# EAGLE board M865C (EAGLE 6.6.0), part 1 of 2
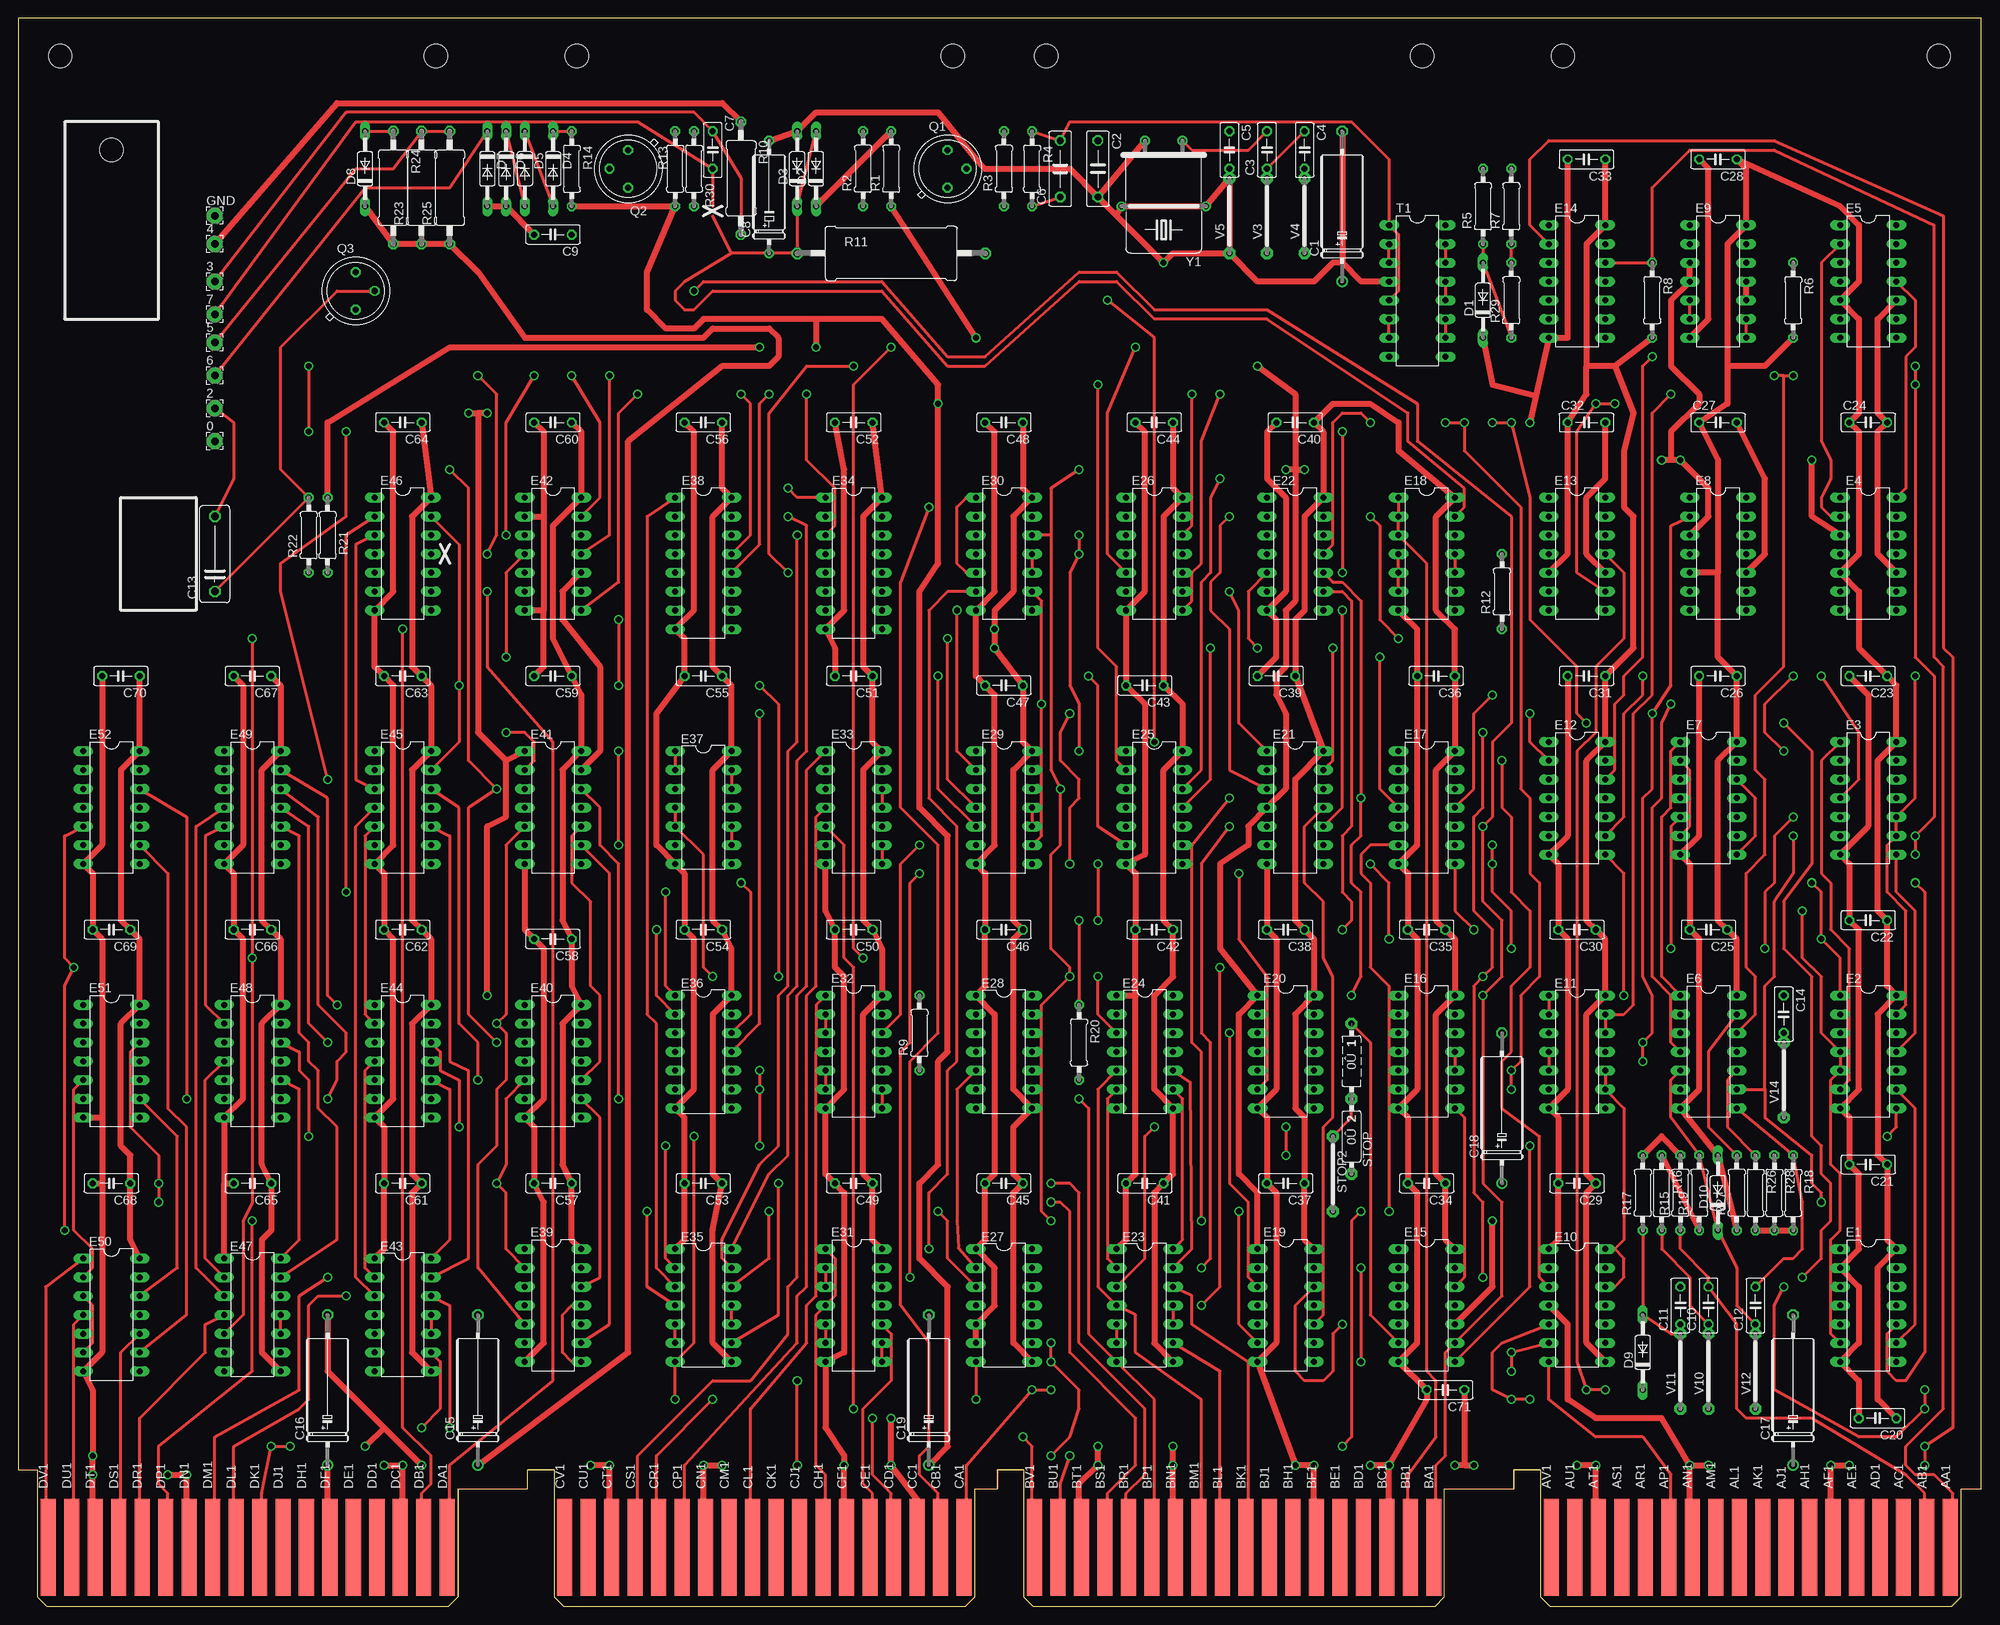
[diagram p2: board, top side]
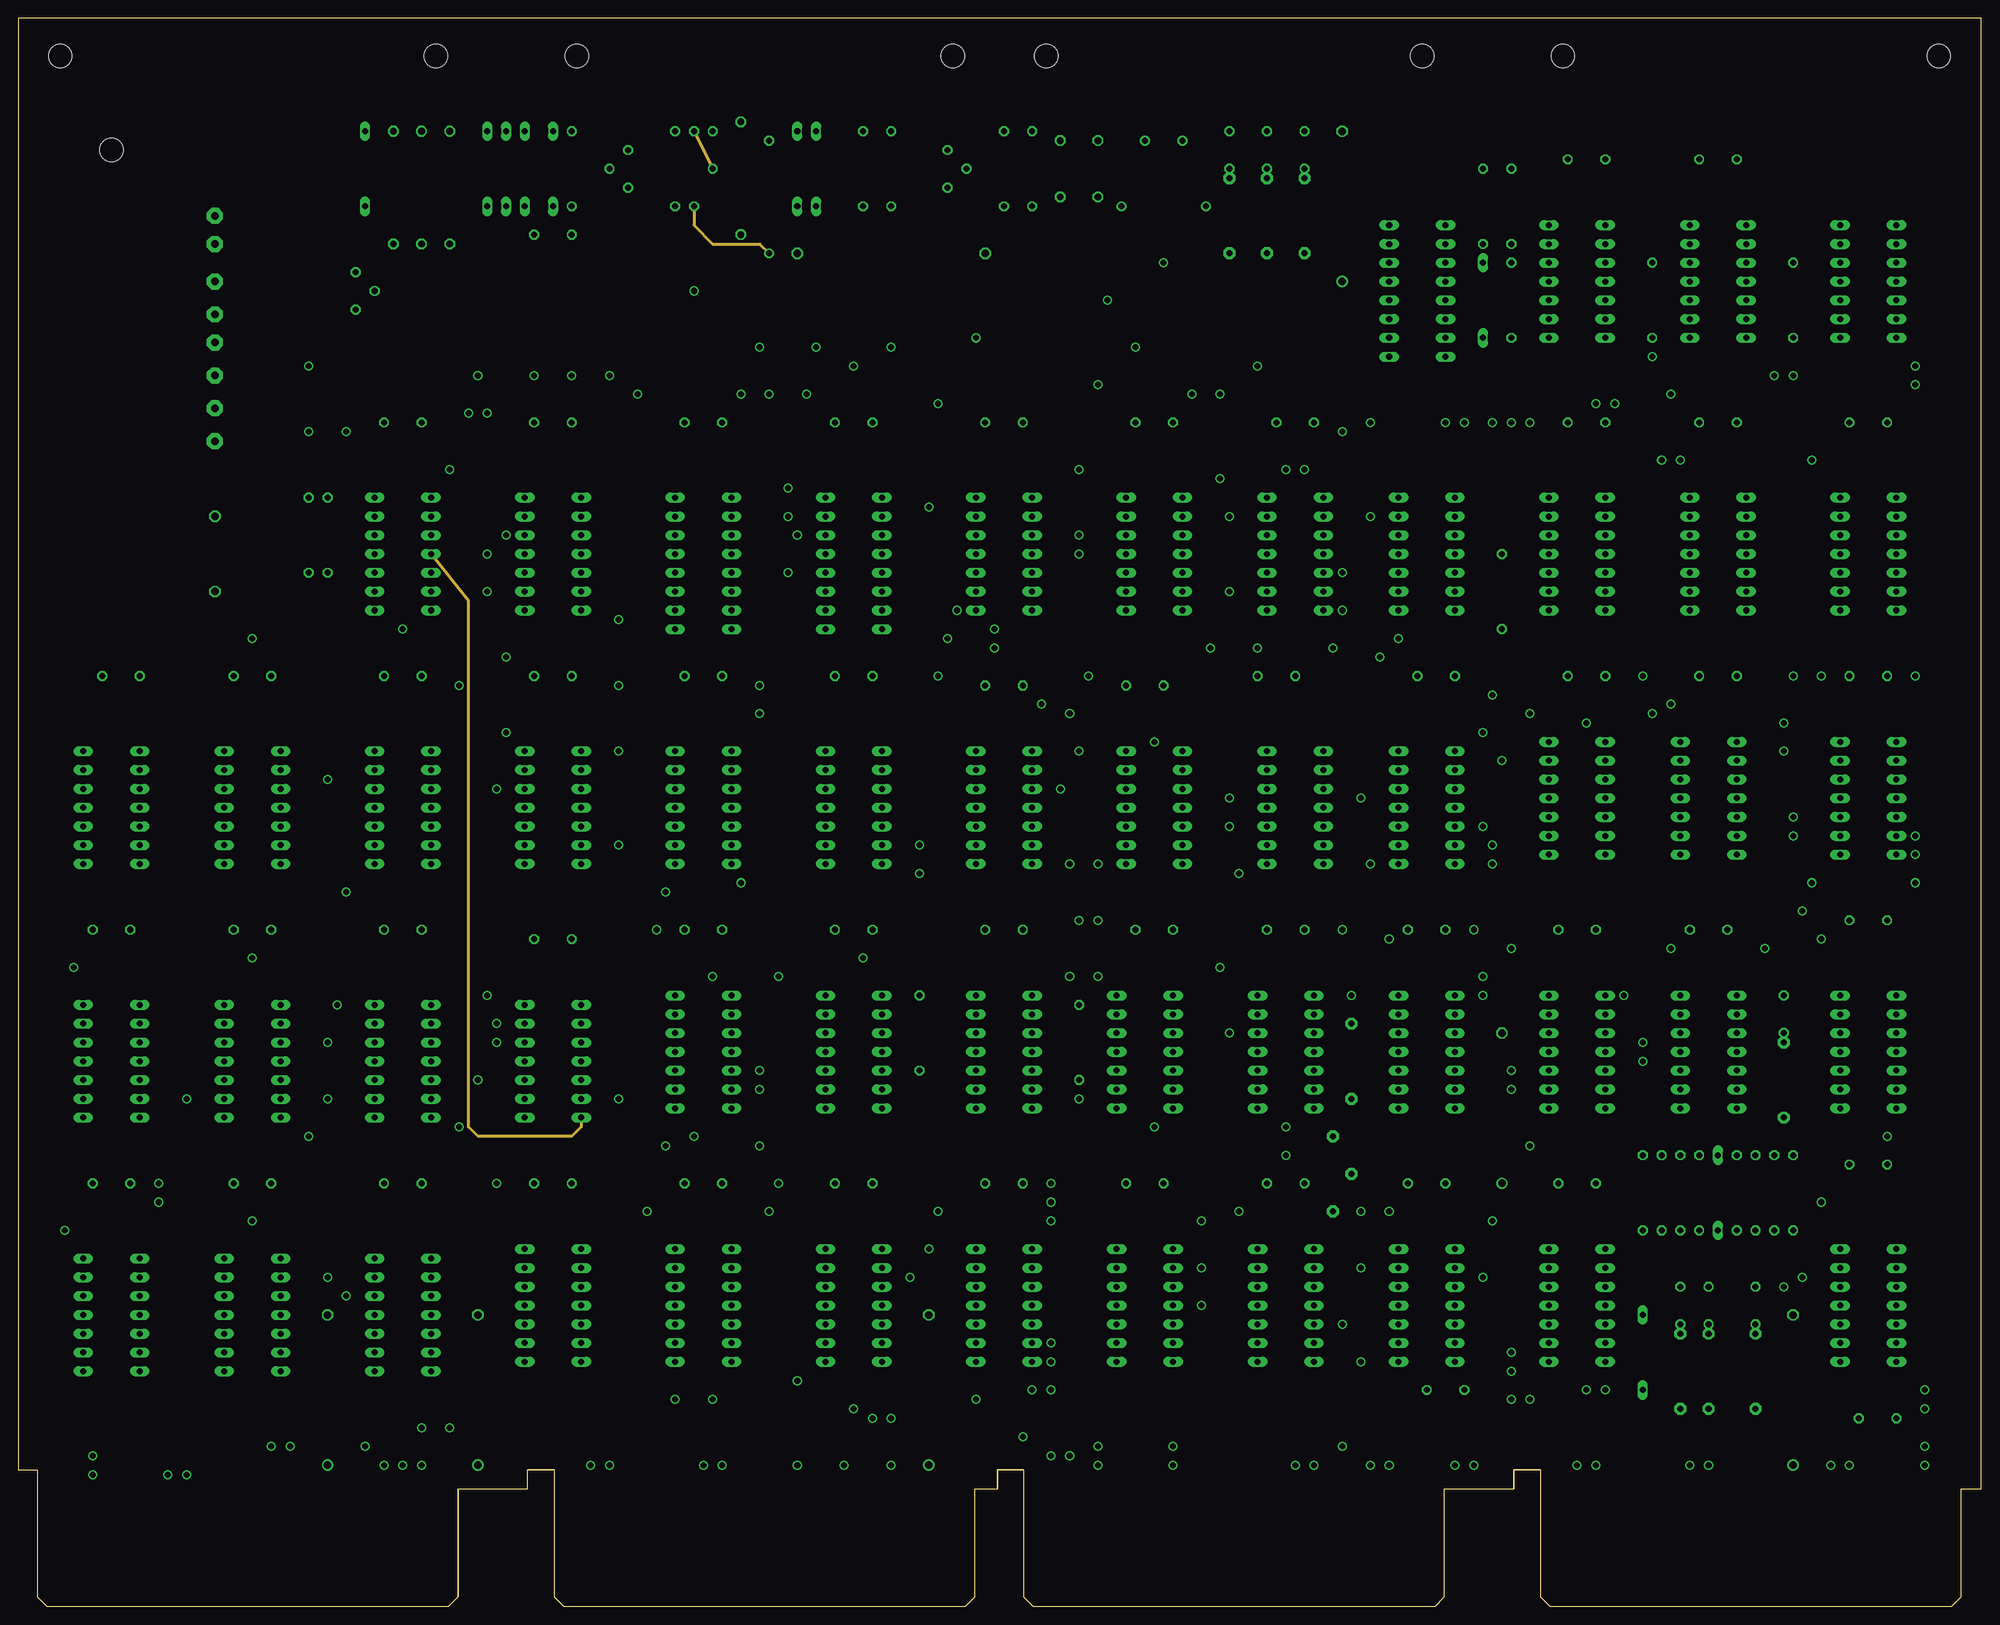
[diagram p3: board, inner layer ECO]
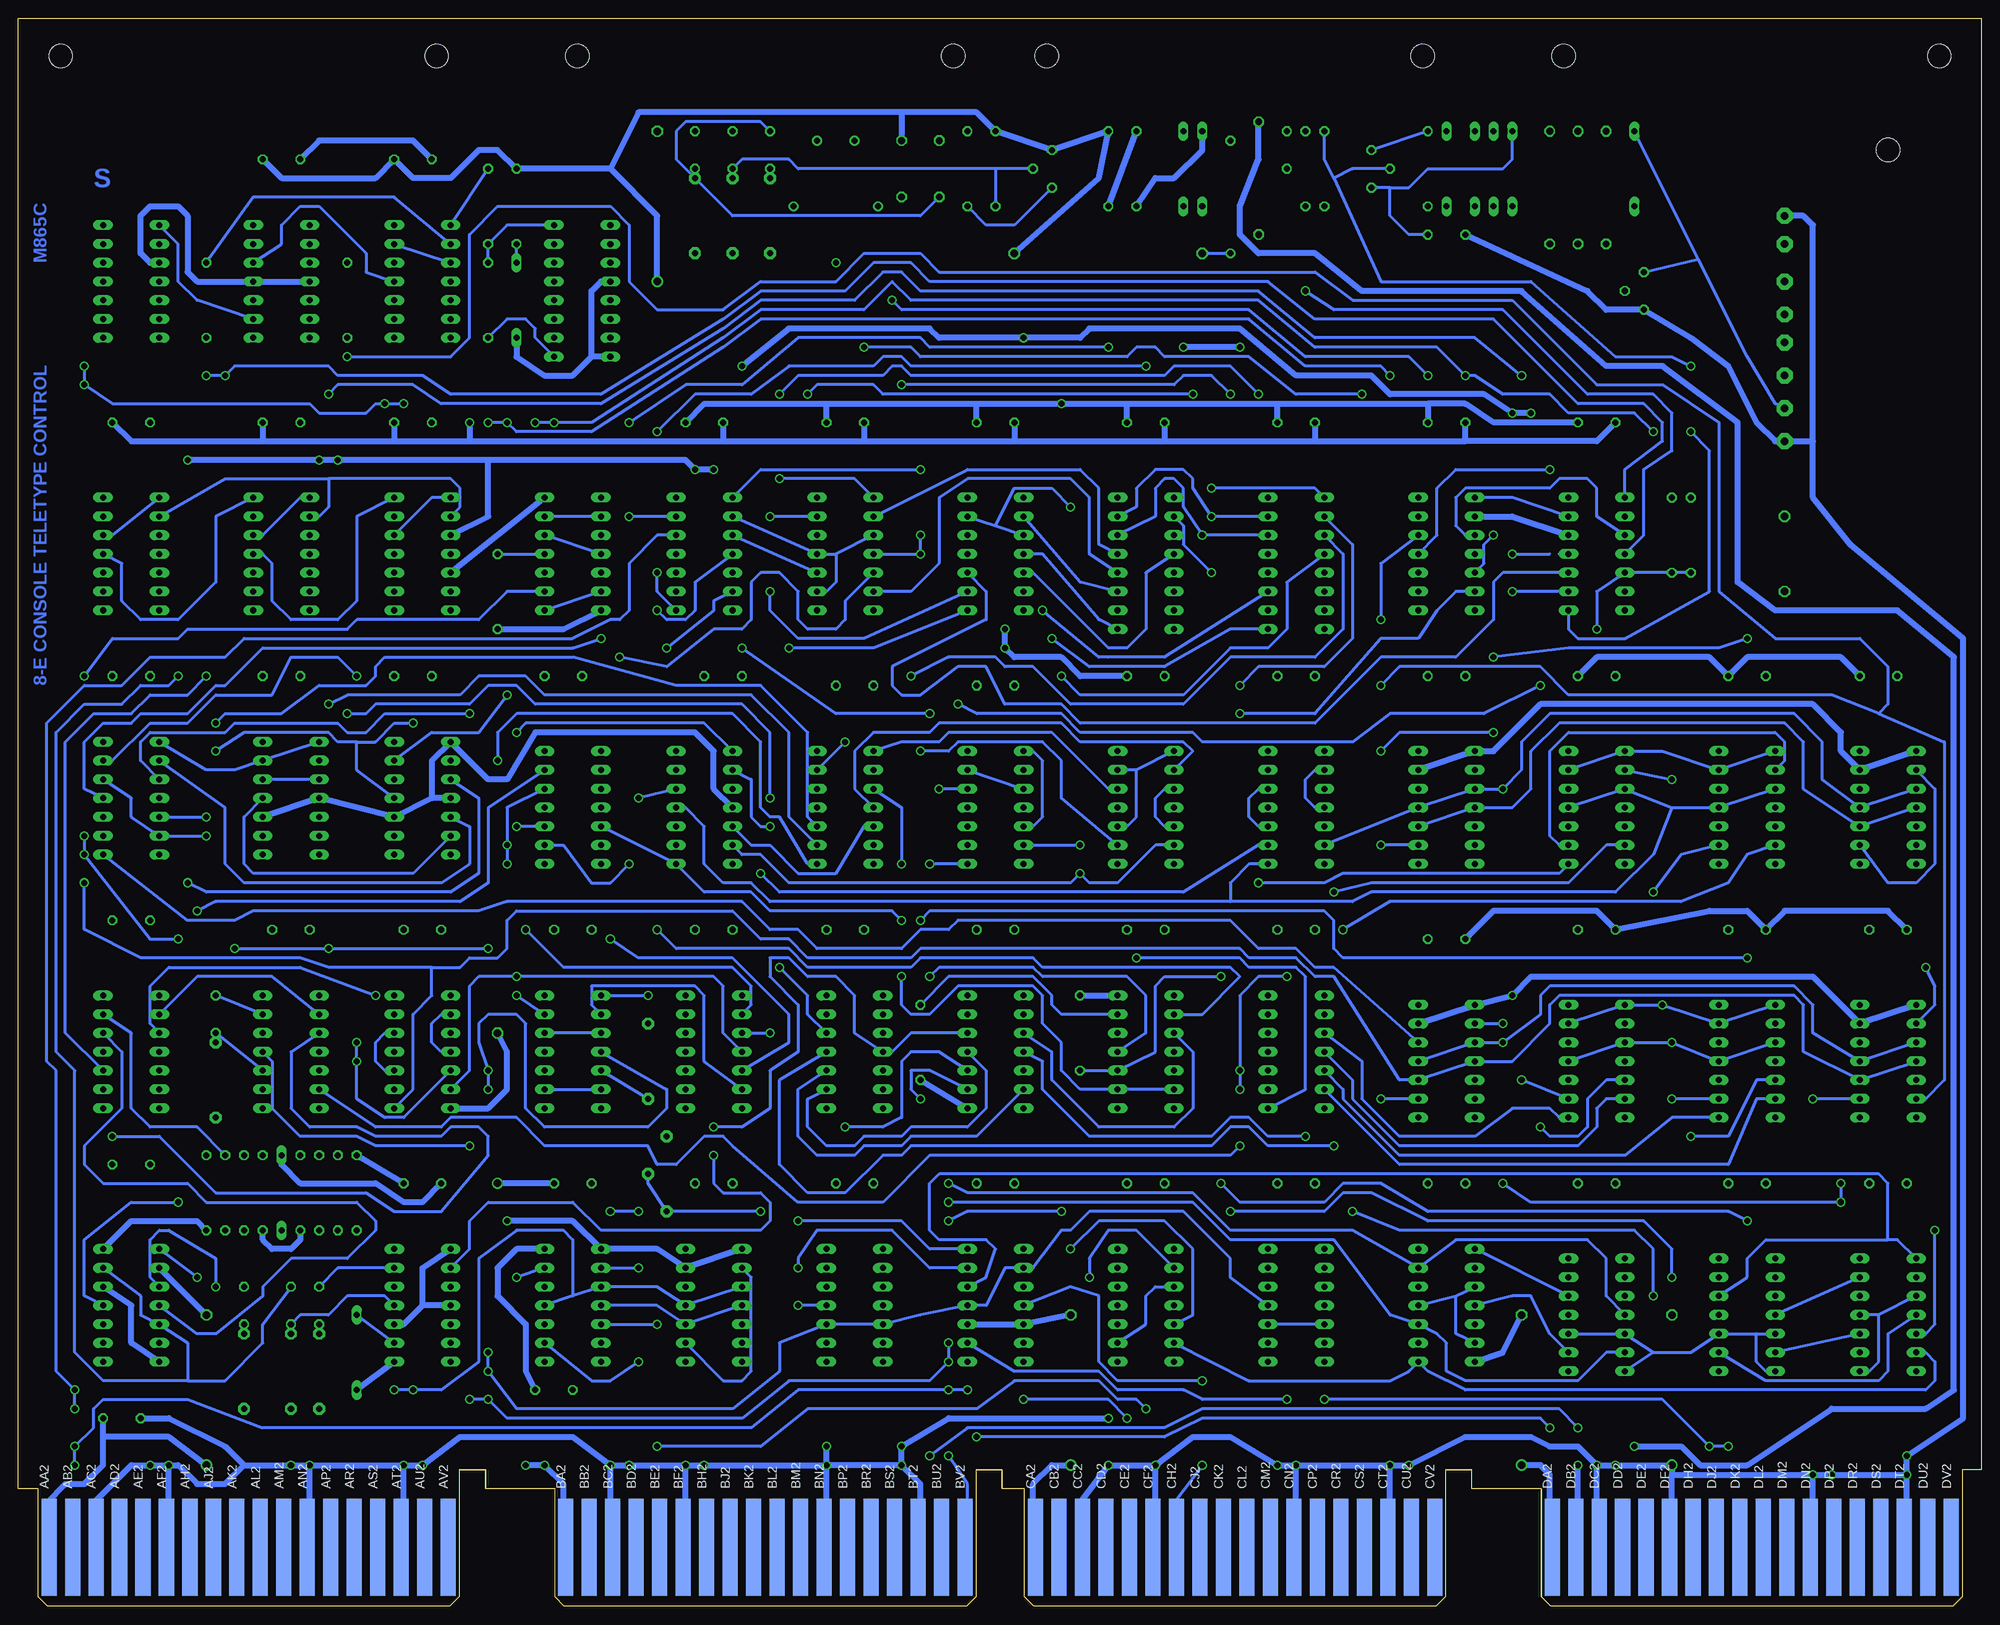
[diagram p4: board, bottom side, seen from below]

Size 265.3 x 214.63 mm. Coordinates in mm from the lower left corner, seen from the top.
Copper layers (1+2+16): Top 0.035mm / dielectric 1.5mm / ECO 0.035mm / dielectric 0.15mm / Bottom 0.035mm
Design rules "16mils *": minimum track width 16mil, minimum drill 32mil, track to track 15mil, track to pad 10mil, pad to pad 10mil, via to via 10mil, smd to smd 10mil, copper to edge 13mil, drill to drill 10mil, minimum pad ring 10mil, minimum via ring 8mil, stop-mask expansion 0mil, vias tented up to drill 0mil, thermal gap 10mil
Net classes: 1 Supply: width 0.813 mm
Holes 3.17 mm at 12.57,196.85

## Footprints (pad centres in the part's own frame; a part is rotated, then mirrored left to right if it is on the bottom)
2,15/1,0 = drill 1.016 pad 2.159 octagon: 1 0,0
E12-8 = drill 1.016: + -10.16,0 | drill 1.016 octagon: - 10.16,0
C075-032X103 = drill 0.914 octagon: 1 -3.81,0; 2 3.81,0
C050-025X075 = drill 0.813 octagon: 1 -2.54,0; 2 2.54,0
E15-5 = drill 0.813: + -7.62,0 | drill 0.813 octagon: - 7.62,0
C102-043X133 = drill 1.016 octagon: 1 -5.08,0; 2 5.08,0
DO35-10 = drill 0.813 long: A 5.08,0; C -5.08,0
DIL14 = drill 0.813 long: 1 -7.62,-3.81; 2 -5.08,-3.81; 3 -2.54,-3.81; 4 0,-3.81; 5 2.54,-3.81; 6 5.08,-3.81; 7 7.62,-3.81; 8 7.62,3.81; 9 5.08,3.81; 10 2.54,3.81; 11 0,3.81; 12 -2.54,3.81; 13 -5.08,3.81; 14 -7.62,3.81
DIL16 = drill 0.813 long: 1 -8.89,-3.81; 2 -6.35,-3.81; 3 -3.81,-3.81; 4 -1.27,-3.81; 5 1.27,-3.81; 6 3.81,-3.81; 7 6.35,-3.81; 8 8.89,-3.81; 9 8.89,3.81; 10 6.35,3.81; 11 3.81,3.81; 12 1.27,3.81; 13 -1.27,3.81; 14 -3.81,3.81; 15 -6.35,3.81; 16 -8.89,3.81
TO5 = drill 0.813 octagon: 1 0,-2.54; 2 2.54,0; 3 0,2.54
0207/10 = drill 0.813 octagon: 1 -5.08,0; 2 5.08,0
0411/15 = drill 0.914 octagon: 1 -7.62,0; 2 7.62,0
0818/25 = drill 1.016 octagon: 1 -12.7,0; 2 12.7,0
0R2/10 = drill 0.813 pad 1.6 octagon: 1 -5.08,0; 2 5.08,0; 3 15.24,0
10 = drill 0.813 pad 1.6 octagon: 1 -5.08,0; 2 5.08,0
EDGE-CON8 = smd 2.032 x 13.106: AA1 261.303,7.938; AB1 258.127,7.938; AC1 254.952,7.938; AD1 251.778,7.938; AE1 248.602,7.938; AF1 245.428,7.938; AH1 242.252,7.938; AJ1 239.077,7.938; AK1 235.903,7.938; AL1 232.727,7.938; AM1 229.553,7.938; AN1 226.377,7.938; AP1 223.202,7.938; AR1 220.028,7.938; AS1 216.852,7.938; AT1 213.678,7.938; AU1 210.502,7.938; AV1 207.327,7.938; BA1 191.452,7.938; BB1 188.278,7.938; BC1 185.102,7.938; BD1 181.928,7.938; BE1 178.752,7.938; BF1 175.577,7.938; BH1 172.403,7.938; BJ1 169.227,7.938; BK1 166.053,7.938; BL1 162.877,7.938; BM1 159.702,7.938; BN1 156.528,7.938; BP1 153.352,7.938; BR1 150.178,7.938; BS1 147.002,7.938; BT1 143.827,7.938; BU1 140.653,7.938; BV1 137.477,7.938; CA1 127.953,7.938; CB1 124.778,7.938; CC1 121.603,7.938; CD1 118.427,7.938; CE1 115.252,7.938; CF1 112.078,7.938; CH1 108.903,7.938; CJ1 105.728,7.938; CK1 102.552,7.938; CL1 99.377,7.938; CM1 96.203,7.938; CN1 93.028,7.938; CP1 89.853,7.938; CR1 86.677,7.938; CS1 83.502,7.938; CT1 80.328,7.938; CU1 77.153,7.938; CV1 73.978,7.938; DA1 58.102,7.938; DB1 54.928,7.938; DC1 51.752,7.938; DD1 48.578,7.938; DE1 45.403,7.938; DF1 42.227,7.938; DH1 39.053,7.938; DJ1 35.877,7.938; DK1 32.703,7.938; DL1 29.527,7.938; DM1 26.352,7.938; DN1 23.177,7.938; DP1 20.003,7.938; DR1 16.828,7.938; DS1 13.652,7.938; DT1 10.477,7.938; DU1 7.303,7.938; DV1 4.128,7.938 | smd 2.032 x 13.106 bottom: AA2 261.303,7.938; AB2 258.127,7.938; AC2 254.952,7.938; AD2 251.778,7.938; AE2 248.602,7.938; AF2 245.428,7.938; AH2 242.252,7.938; AJ2 239.077,7.938; AK2 235.903,7.938; AL2 232.727,7.938; AM2 229.553,7.938; AN2 226.377,7.938; AP2 223.202,7.938; AR2 220.028,7.938; AS2 216.852,7.938; AT2 213.678,7.938; AU2 210.502,7.938; AV2 207.327,7.938; BA2 191.452,7.938; BB2 188.278,7.938; BC2 185.102,7.938; BD2 181.928,7.938; BE2 178.752,7.938; BF2 175.577,7.938; BH2 172.403,7.938; BJ2 169.227,7.938; BK2 166.053,7.938; BL2 162.877,7.938; BM2 159.702,7.938; BN2 156.528,7.938; BP2 153.352,7.938; BR2 150.178,7.938; BS2 147.002,7.938; BT2 143.827,7.938; BU2 140.653,7.938; BV2 137.477,7.938; CA2 127.953,7.938; CB2 124.778,7.938; CC2 121.603,7.938; CD2 118.427,7.938; CE2 115.252,7.938; CF2 112.078,7.938; CH2 108.903,7.938; CJ2 105.728,7.938; CK2 102.552,7.938; CL2 99.377,7.938; CM2 96.203,7.938; CN2 93.028,7.938; CP2 89.853,7.938; CR2 86.677,7.938; CS2 83.502,7.938; CT2 80.328,7.938; CU2 77.153,7.938; CV2 73.978,7.938; DA2 58.102,7.938; DB2 54.928,7.938; DC2 51.752,7.938; DD2 48.578,7.938; DE2 45.403,7.938; DF2 42.227,7.938; DH2 39.053,7.938; DJ2 35.877,7.938; DK2 32.703,7.938; DL2 29.527,7.938; DM2 26.352,7.938; DN2 23.177,7.938; DP2 20.003,7.938; DR2 16.828,7.938; DS2 13.652,7.938; DT2 10.477,7.938; DU2 7.303,7.938; DV2 4.128,7.938
OMNIBUS = hole 3.175: 208.915,209.55; 259.715,209.55; 189.865,209.55; 139.065,209.55; 75.616,209.55; 126.416,209.55; 56.566,209.55; 5.766,209.55
HC18U-H = drill 0.813: 1 -2.54,-5.08; 2 2.54,-5.08; M -5.715,3.81; M1 5.715,3.81

## Placement (x,y rotation side)
0  [2,15/1,0]  26.54,157.48 0 top
2  [2,15/1,0]  26.54,161.93 0 top
3  [2,15/1,0]  26.54,179.07 0 top
4  [2,15/1,0]  26.54,184.15 0 top
5  [2,15/1,0]  26.54,170.81 0 top
6  [2,15/1,0]  26.54,166.37 0 top
7  [2,15/1,0]  26.54,174.62 0 top
C1  6.8uF  [E12-8]  178.94,189.23 90 top
C2  .047uF  [C075-032X103]  145.92,194.31 270 top
C3  33pF  [C050-025X075]  168.78,196.85 90 top
C4  100pF  [C050-025X075]  173.86,196.85 270 top
C5  68pF  [C050-025X075]  163.7,196.85 270 top
C6  .047uF  [C075-032X103]  140.84,194.31 90 top
C7  .01uF  [C050-025X075]  93.85,196.85 90 top
C8  1uF  [E15-5]  101.47,190.5 90 top
C9  .01uF  [C050-025X075]  72.26,185.42 180 top
C10  56pF  [C050-025X075]  228.47,40.64 90 top
C11  330pF  [C050-025X075]  224.66,40.64 90 top
C12  330pF  [C050-025X075]  234.82,40.64 90 top
C13  3300pF  [C102-043X133]  26.54,142.24 90 top
C14  330pF  [C050-025X075]  238.63,80.01 270 top
C15  6.8uF  [E12-8]  62.1,29.21 90 top
C16  6.8uF  [E12-8]  41.78,29.21 90 top
C17  6.8uF  [E12-8]  239.9,29.21 90 top
C18  6.8uF  [E12-8]  200.53,67.31 90 top
C19  6.8uF  [E12-8]  123.06,29.21 90 top
C20  .01uF  [C050-025X075]  251.33,25.4 180 top
C21  .01uF  [C050-025X075]  250.06,59.69 180 top
C22  .01uF  [C050-025X075]  250.06,92.71 180 top
C23  .01uF  [C050-025X075]  250.06,125.73 180 top
C24  .01uF  [C050-025X075]  250.06,160.02 0 top
C25  .01uF  [C050-025X075]  228.47,91.44 180 top
C26  .01uF  [C050-025X075]  229.74,125.73 180 top
C27  .01uF  [C050-025X075]  229.74,160.02 0 top
C28  .01uF  [C050-025X075]  229.74,195.58 180 top
C29  .01uF  [C050-025X075]  210.69,57.15 180 top
C30  .01uF  [C050-025X075]  210.69,91.44 180 top
C31  .01uF  [C050-025X075]  211.96,125.73 180 top
C32  .01uF  [C050-025X075]  211.96,160.02 0 top
C33  .01uF  [C050-025X075]  211.96,195.58 180 top
C34  .01uF  [C050-025X075]  190.37,57.15 180 top
C35  .01uF  [C050-025X075]  190.37,91.44 180 top
C36  .01uF  [C050-025X075]  191.64,125.73 180 top
C37  .01uF  [C050-025X075]  171.32,57.15 180 top
C38  .01uF  [C050-025X075]  171.32,91.44 180 top
C39  .01uF  [C050-025X075]  170.05,125.73 180 top
C40  .01uF  [C050-025X075]  172.59,160.02 180 top
C41  .01uF  [C050-025X075]  152.27,57.15 180 top
C42  .01uF  [C050-025X075]  153.54,91.44 180 top
C43  .01uF  [C050-025X075]  152.27,124.46 180 top
C44  .01uF  [C050-025X075]  153.54,160.02 180 top
C45  .01uF  [C050-025X075]  133.22,57.15 180 top
C46  .01uF  [C050-025X075]  133.22,91.44 180 top
C47  .01uF  [C050-025X075]  133.22,124.46 180 top
C48  .01uF  [C050-025X075]  133.22,160.02 180 top
C49  .01uF  [C050-025X075]  112.9,57.15 180 top
C50  .01uF  [C050-025X075]  112.9,91.44 180 top
C51  .01uF  [C050-025X075]  112.9,125.73 180 top
C52  .01uF  [C050-025X075]  112.9,160.02 180 top
C53  .01uF  [C050-025X075]  92.58,57.15 180 top
C54  .01uF  [C050-025X075]  92.58,91.44 180 top
C55  .01uF  [C050-025X075]  92.58,125.73 180 top
C56  .01uF  [C050-025X075]  92.58,160.02 180 top
C57  .01uF  [C050-025X075]  72.26,57.15 180 top
C58  .01uF  [C050-025X075]  72.26,90.17 180 top
C59  .01uF  [C050-025X075]  72.26,125.73 180 top
C60  .01uF  [C050-025X075]  72.26,160.02 180 top
C61  .01uF  [C050-025X075]  51.94,57.15 180 top
C62  .01uF  [C050-025X075]  51.94,91.44 180 top
C63  .01uF  [C050-025X075]  51.94,125.73 180 top
C64  .01uF  [C050-025X075]  51.94,160.02 180 top
C65  .01uF  [C050-025X075]  31.62,57.15 180 top
C66  .01uF  [C050-025X075]  31.62,91.44 180 top
C67  .01uF  [C050-025X075]  31.62,125.73 180 top
C68  .01uF  [C050-025X075]  12.57,57.15 180 top
C69  .01uF  [C050-025X075]  12.57,91.44 180 top
C70  .01uF  [C050-025X075]  13.84,125.73 180 top
C71  .01uF  [C050-025X075]  192.91,29.21 180 top
D1  D662  [DO35-10]  197.99,176.53 90 top
D2  D664  [DO35-10]  107.82,194.31 90 top
D3  D664  [DO35-10]  105.28,194.31 90 top
D4  D664  [DO35-10]  72.26,194.31 270 top
D5  D664  [DO35-10]  68.45,194.31 270 top
D6  D664  [DO35-10]  65.91,194.31 270 top
D7  D664  [DO35-10]  63.37,194.31 270 top
D8  D664  [DO35-10]  46.86,194.31 90 top
D9  D664  [DO35-10]  219.58,34.29 90 top
D10  D664  [DO35-10]  229.74,55.88 90 top
E1  7474N  [DIL14]  250.06,40.64 270 top
E2  7410N  [DIL14]  250.06,74.93 270 top
E3  7400N  [DIL14]  250.06,109.22 270 top
E4  74LS93N  [DIL14]  250.06,142.24 270 top
E5  74LS93N  [DIL14]  250.06,179.07 270 top
E6  7404N  [DIL14]  228.47,74.93 270 top
E7  7474N  [DIL14]  228.47,109.22 270 top
E8  74LS93N  [DIL14]  229.74,142.24 270 top
E9  74H72N  [DIL14]  229.74,179.07 270 top
E10  SP380N  [DIL14]  210.69,40.64 270 top
E11  7440N  [DIL14]  210.69,74.93 270 top
E12  7474N  [DIL14]  210.69,109.22 270 top
E13  74LS93N  [DIL14]  210.69,142.24 270 top
E14  74H00N  [DIL14]  210.69,179.07 270 top
E15  7474N  [DIL14]  190.37,40.64 270 top
E16  7400N  [DIL14]  190.37,74.93 270 top
E17  7400N  [DIL14]  190.37,107.95 270 top
E18  7460N  [DIL14]  190.37,142.24 270 top
E19  7474N  [DIL14]  171.32,40.64 270 top
E20  7474N  [DIL14]  171.32,74.93 270 top
E21  7474N  [DIL14]  172.59,107.95 270 top
E22  7404N  [DIL14]  172.59,142.24 270 top
E23  SP380N  [DIL14]  152.27,40.64 270 top
E24  SP314N  [DIL14]  152.27,74.93 270 top
E25  7402N  [DIL14]  153.54,107.95 270 top
E26  7402N  [DIL14]  153.54,142.24 270 top
E27  SP384N  [DIL14]  133.22,40.64 270 top
E28  SP314N  [DIL14]  133.22,74.93 270 top
E29  7400N  [DIL14]  133.22,107.95 270 top
E30  7400N  [DIL14]  133.22,142.24 270 top
E31  97401N  [DIL14]  112.9,40.64 270 top
E32  97401N  [DIL14]  112.9,74.93 270 top
E33  97401N  [DIL14]  112.9,107.95 270 top
E34  DEC8251  [DIL16]  112.9,140.97 270 top
E35  SP380N  [DIL14]  92.58,40.64 270 top
E36  7430N  [DIL14]  92.58,74.93 270 top
E37  7440N  [DIL14]  92.58,107.95 270 top
E38  DEC8251  [DIL16]  92.58,140.97 270 top
E39  97401N  [DIL14]  72.26,40.64 270 top
E40  7474N  [DIL14]  72.26,73.66 270 top
E41  7474N  [DIL14]  72.26,107.95 270 top
E42  7474N  [DIL14]  72.26,142.24 270 top
E43  SP384N  [DIL14]  51.94,39.37 270 top
E44  7474N  [DIL14]  51.94,73.66 270 top
E45  7474N  [DIL14]  51.94,107.95 270 top
E46  7474N  [DIL14]  51.94,142.24 270 top
E47  SP384N  [DIL14]  31.62,39.37 270 top
E48  7474N  [DIL14]  31.62,73.66 270 top
E49  7474N  [DIL14]  31.62,107.95 270 top
E50  97401N  [DIL14]  12.57,39.37 270 top
E51  7474N  [DIL14]  12.57,73.66 270 top
E52  7474N  [DIL14]  12.57,107.95 270 top
GND  [2,15/1,0]  26.54,187.96 0 top
Q1  2N3009B  [TO5]  125.6,194.31 0 top
Q2  MPS6534D  [TO5]  82.42,194.31 180 top
Q3  2N3009B  [TO5]  45.59,177.8 0 top
R1  330  [0207/10]  117.98,194.31 90 top
R2  750  [0207/10]  114.17,194.31 90 top
R3  10K  [0207/10]  133.22,194.31 90 top
R4  220  [0207/10]  137.03,194.31 270 top
R5  470  [0207/10]  197.99,189.23 90 top
R6  1.5K  [0207/10]  239.9,176.53 270 top
R7  470  [0207/10]  201.8,189.23 90 top
R8  1.5K  [0207/10]  220.85,176.53 270 top
R9  470  [0207/10]  121.79,77.47 90 top
R10  560 1/2W  [0411/15]  97.66,193.04 270 top
R11  750 2W  [0818/25]  117.98,182.88 0 top
R12  100  [0207/10]  200.53,137.16 90 top
R13  1K  [0207/10]  88.77,194.31 270 top
R14  150  [0207/10]  74.8,194.31 270 top
R15  4.7K  [0207/10]  224.66,55.88 90 top
R16  7.5K  [0207/10]  222.12,55.88 270 top
R17  1.8K  [0207/10]  219.58,55.88 90 top
R18  470  [0207/10]  239.9,55.88 270 top
R19  220  [0207/10]  227.2,55.88 90 top
R20  470  [0207/10]  143.38,76.2 270 top
R21  1.5K  [0207/10]  41.78,144.78 90 top
R22  390  [0207/10]  39.24,144.78 90 top
R23  680 1/2W  [0411/15]  54.48,191.77 90 top
R24  750 1/2W  [0411/15]  50.67,191.77 270 top
R25  680 1/2W  [0411/15]  58.29,191.77 90 top
R26  470  [0207/10]  234.82,55.88 270 top
R27  220  [0207/10]  232.28,55.88 90 top
R28  1K  [0207/10]  237.36,55.88 270 top
R29  3.3K  [0207/10]  201.8,176.53 90 top
R30  180  [0207/10]  91.31,194.31 270 top
STOP  [0R2/10]  180.21,63.5 90 top
STOP2  [10]  177.67,58.42 270 top
T1  16-09651  [DIL16]  189.1,177.8 270 top
U$1  [EDGE-CON8]  -0.13,0 0 top
U$2  OUTLINE-OMNIBUS  [OMNIBUS]  -0.13,0 0 top
V3  [10]  168.78,187.96 90 top
V4  [10]  173.86,187.96 90 top
V5  [10]  163.7,187.96 90 top
V10  [10]  228.47,31.75 90 top
V11  [10]  224.66,31.75 90 top
V12  [10]  234.82,31.75 90 top
V14  [10]  238.63,71.12 90 top
Y1  14.418MHz  [HC18U-H]  154.81,193.04 180 top

## Tracks (layer width: path | path; a pad name or v marks a point on that pad's centre or on a via)
603X  (via drill 0.81)
  Top 0.406: E32.2 E32.3 | E22.9 178.94,137.16 180.21,135.89 180.21,105.41 178.94,104.14 178.94,96.52 180.21,95.25 180.21,92.71 v178.94,91.44
  Bottom 0.406: E32.2 105.28,80.01 100.2,85.09 101.47,86.36 126.87,86.36 128.14,87.63 143.38,87.63 144.65,86.36 158.62,86.36 161.16,88.9 176.4,88.9 v178.94,91.44 | E32.3 106.55,74.93 106.55,67.31 109.09,64.77 119.25,64.77 125.6,71.12 125.6,74.93 E28.3
604X  (via drill 0.81)
  Top 0.406: E32.5 E32.6 | E32.9 E32.8 | E24.3 145.92,80.01 v145.92,85.09
  Bottom 0.406: E32.6 E32.9 121.79,69.85 124.33,72.39 124.33,76.2 126.87,78.74 126.87,82.55 128.14,83.82 138.3,83.82 142.11,80.01 144.65,80.01 145.92,81.28 v145.92,85.09
!603  (via drill 0.81)
  Top 0.406: v104.01,139.7 101.47,142.24 101.47,161.29 106.55,167.64 v112.9,167.64 | v178.94,158.75 v178.94,139.7
  Bottom 0.406: E34.2 107.82,146.05 107.82,143.51 v104.01,139.7 | E22.8 178.94,137.16 v178.94,139.7 | v112.9,167.64 144.65,167.64 145.92,168.91 148.46,168.91 149.73,167.64 161.16,167.64 166.24,163.83 173.86,163.83 v178.94,158.75
!604  (via drill 0.81)
  Top 0.406: v100.2,124.46 102.74,121.92 v102.74,85.09
  Bottom 0.406: E38.2 84.96,143.51 84.96,130.81 88.77,127 97.66,127 v100.2,124.46 | R9.1 E32.10 111.63,74.93 111.63,83.82 110.36,85.09 v102.74,85.09
!C0
  Top 0.406: U$1.CE1 115.44,8.89 115.44,15.24 114.17,16.51 114.17,26.67 117.98,30.48 117.98,36.83 E31.10
!C1
  Top 0.406: U$1.CH1 109.09,8.89 109.09,17.78 107.82,19.05 107.82,39.37 E31.4 110.36,41.91 110.36,46.99 E31.1
!CLR_ACTIVE  (via drill 0.81)
  Top 0.406: v241.17,44.45 243.71,46.99 243.71,50.8 244.98,52.07 244.98,57.15 243.71,58.42 243.71,62.23 242.44,63.5 242.44,85.09 238.63,88.9 238.63,95.25 242.44,100.33 242.44,115.57 v238.63,119.38
  Bottom 0.406: E1.1 v241.17,44.45 | E25.10 158.62,106.68 158.62,118.11 164.97,124.46 176.4,124.46 190.37,128.27 215.77,128.27 217.04,127 217.04,125.73 218.31,124.46 224.66,124.46 229.74,120.65 237.36,120.65 v238.63,119.38
!DATA4  (via drill 0.81)
  Top 0.406: U$1.BR1 149.73,11.43 149.73,15.24 152.27,17.78 152.27,26.67 143.38,35.56 143.38,55.88 142.11,57.15 v139.57,57.15
  Bottom 0.406: E43.4 50.67,41.91 50.67,46.99 53.21,49.53 70.99,49.53 E39.13 84.96,50.8 101.47,50.8 106.55,55.88 137.03,55.88 v139.57,57.15
!DATA5  (via drill 0.81)
  Top 0.406: U$1.BS1 147.19,10.16 147.19,15.24 151,19.05 151,25.4 142.11,34.29 142.11,53.34 140.84,54.61 v139.57,54.61
  Bottom 0.406: E43.6 50.67,34.29 54.48,30.48 69.72,30.48 72.26,31.75 72.26,35.56 73.53,36.83 E39.10 79.88,39.37 87.5,49.53 101.47,49.53 106.55,54.61 v139.57,54.61
!DATA6  (via drill 0.81)
  Top 0.406: E43.9 57.02,33.02 57.02,26.67 v54.48,24.13 | U$1.BU1 140.84,10.16 140.84,16.51 v142.11,20.32
  Bottom 0.406: E43.9 58.29,36.83 60.83,41.91 63.37,41.91 E39.4 | v54.48,24.13 57.02,26.67 105.28,26.67 110.36,24.13 137.03,24.13 v142.11,20.32
!DATA7  (via drill 0.81)
  Top 0.406: U$1.BV1 137.03,10.16 137.03,21.59 v135.76,22.86 | E43.12 58.29,40.64 v58.29,24.13
  Bottom 0.406: E43.12 E39.1 | v58.29,24.13 59.56,25.4 105.28,25.4 110.36,22.86 v135.76,22.86
!DATA8
  Top 0.406: U$1.DR1 16.38,8.89 16.38,25.4 25.27,34.29 25.27,38.1 E47.4
  Bottom 0.406: E50.13 E47.4
!DATA9
  Top 0.406: U$1.DS1 13.84,8.89 13.84,34.29 E50.10
  Bottom 0.406: E50.10 E47.6
!DATA10
  Top 0.406: U$1.DU1 7.49,8.89 7.49,38.1 E50.4
  Bottom 0.406: E50.4 12.57,36.83 12.57,31.75 13.84,30.48 29.08,30.48 E47.9
!DATA11
  Top 0.406: E50.1 3.68,43.18 3.68,8.89 U$1.DV1
  Bottom 0.406: E50.1 11.3,49.53 12.57,49.53 | 12.57,49.53 12.57,57.15 13.84,58.42 140.84,58.42 142.11,57.15 142.11,50.8 140.84,49.53 134.49,49.53 133.22,48.26 134.49,44.45 E27.12 | E47.12 31.62,44.45 31.62,46.99 29.08,49.53 12.57,49.53
!DTX_ACTIVE  (via drill 0.81)
  Top 0.406: E6.12 234.82,80.01 234.82,85.09 233.55,86.36 233.55,99.06 236.09,101.6 236.09,111.76 234.82,113.03 234.82,123.19 238.63,127 238.63,166.37 | 238.63,166.37 v237.36,166.37 | 238.63,166.37 v239.9,166.37
  Bottom 0.406: E46.1 48.13,153.67 43.05,157.48 43.05,160.02 45.59,162.56 54.48,162.56 65.91,173.99 90.04,173.99 96.39,179.07 142.11,179.07 144.65,181.61 149.73,181.61 153.54,177.8 164.97,177.8 170.05,173.99 186.56,163.83 206.88,163.83 210.69,166.37 222.12,166.37 223.39,167.64 236.09,167.64 v237.36,166.37 v239.9,166.37
!ENABLE  (via drill 0.81)
  Top 0.406: E36.11 100.2,78.74 v100.2,120.65
  Bottom 0.406: E42.6 70.99,137.16 73.53,134.62 76.07,130.81 81.15,130.81 90.04,120.65 v100.2,120.65
!FREQ_DIV  (via drill 0.81)
  Top 0.406: v41.78,76.2 39.24,78.74 39.24,105.41 E49.11 | E46.3 45.59,143.51 45.59,111.76 E45.3 | E19.10 176.4,39.37 176.4,64.77 177.67,66.04 177.67,85.09 176.4,87.63 176.4,95.25 173.86,97.79 173.86,105.41 E21.11
  Bottom 0.406: E48.3 E48.11 v41.78,76.2 E44.3 E44.11 | E49.3 E49.11 41.78,107.95 | 41.78,107.95 E45.3 E45.11 | 41.78,107.95 44.32,101.6 49.4,96.52 82.42,96.52 84.96,95.25 101.47,95.25 | E46.3 51.94,147.32 51.94,151.13 53.21,152.4 57.02,152.4 58.29,151.13 69.72,151.13 70.99,149.86 70.99,146.05 69.72,144.78 E42.3 | E19.4 E19.10 178.94,40.64 E15.4 | 101.47,95.25 163.7,95.25 166.24,97.79 170.05,97.79 172.59,100.33 172.59,105.41 175.13,107.95 E21.11 | E37.8 98.93,100.33 101.47,97.79 101.47,95.25
!INITIALIZE  (via drill 0.81)
  Top 0.406: v43.05,81.28 41.78,82.55 41.78,109.22 E49.13 | E46.13 59.56,143.51 v59.56,124.46 59.56,116.84 E45.13 | v197.99,118.11 197.99,107.95 196.72,106.68 196.72,93.98 199.26,91.44 199.26,86.36 v197.99,85.09 196.72,83.82 196.72,55.88 197.99,54.61 v197.99,44.45 | E29.9 138.3,104.14 v138.3,121.92 138.3,135.89 E30.9 | E21.1 164.97,119.38 164.97,134.62 v163.7,137.16
  Bottom 0.406: E48.1 E48.13 v43.05,81.28 E44.1 E44.13 | E49.1 E49.13 43.05,115.57 E45.1 E45.13 | E46.13 63.37,149.86 E42.1 | E15.13 v197.99,44.45 | E20.4 170.05,77.47 170.05,83.82 171.32,85.09 v197.99,85.09 203.07,85.09 204.34,83.82 204.34,72.39 E11.6 | E21.1 172.59,119.38 196.72,119.38 v197.99,118.11 | E30.9 151,130.81 159.89,130.81 163.7,134.62 v163.7,137.16 | v59.56,124.46 67.18,120.65 79.88,120.65 84.96,116.84 105.28,116.84 106.55,118.11 121.79,118.11 124.33,120.65 135.76,120.65 v138.3,121.92
!INT_ENA
  Bottom 0.406: E21.5 166.24,102.87 163.7,102.87 159.89,99.06 154.81,99.06 151,105.41 E25.5
!INT_RQST
  Top 0.406: U$1.CP1 90.04,8.89 90.04,19.05 105.28,35.56 105.28,41.91 106.55,43.18 106.55,82.55 107.82,83.82 107.82,106.68 E33.4
!INTERNAL_IO
  Top 0.406: E32.1 107.82,81.28 107.82,74.93 | 107.82,74.93 E32.4 | U$1.CL1 98.93,8.89 98.93,26.67 106.55,35.56 106.55,40.64 107.82,41.91 107.82,74.93
!IO_PAUSE  (via drill 0.81)
  Top 0.406: E27.7 v129.41,27.94 | U$1.CD1 117.98,8.89 117.98,15.24 115.44,17.78 v115.44,25.4
  Bottom 0.406: v115.44,25.4 117.98,27.94 v129.41,27.94
!KCC
  Bottom 0.406: E34.11 121.79,138.43 E30.2
!KCF
  Bottom 0.406: E34.13 119.25,143.51 119.25,151.13 121.79,153.67 137.03,153.67 E26.2
!KIE  (via drill 0.81)
  Top 0.406: E26.12 158.62,146.05 v158.62,163.83 | E34.3 110.36,146.05 110.36,151.13 106.55,154.94 v106.55,163.83
  Bottom 0.406: v106.55,163.83 148.46,163.83 149.73,165.1 157.35,165.1 v158.62,163.83
!KRB
  Top 0.406: E30.5 128.14,139.7 126.87,140.97 126.87,148.59 128.14,149.86 E30.1
  Bottom 0.406: E34.4 112.9,139.7 112.9,132.08 115.44,129.54 117.98,129.54 128.14,139.7 E30.5
!KRS
  Bottom 0.406: E34.9 119.25,133.35 126.87,142.24 E30.4
!KSF
  Bottom 0.406: E34.12 120.52,142.24 120.52,149.86 123.06,152.4 137.03,152.4 140.84,149.86 140.84,140.97 144.65,137.16 E26.6
!LAST_UNIT  (via drill 0.81)
  Top 0.406: v217.04,82.55 217.04,99.06 E12.8
  Bottom 0.406: E2.3 247.52,78.74 247.52,83.82 244.98,86.36 227.2,86.36 v217.04,82.55
!MD3
  Top 0.406: U$1.AP1 223.39,10.16 223.39,17.78 219.58,22.86 213.23,22.86 206.88,27.94 E10.7
!MD4
  Top 0.406: U$1.BK1 166.24,8.89 166.24,33.02 158.62,38.1 158.62,41.91 E23.12
!MD5
  Top 0.406: U$1.BL1 162.43,10.16 162.43,31.75 E23.9
!MD6
  Top 0.406: U$1.BM1 159.89,10.16 159.89,27.94 151,34.29 151,39.37 E23.4 145.92,43.18 145.92,69.85 E24.5
!MD7  (via drill 0.81)
  Top 0.406: U$1.BP1 153.54,8.89 153.54,27.94 E23.7 144.65,36.83 144.65,67.31 v143.38,68.58
  Bottom 0.406: E28.9 142.11,72.39 144.65,72.39 144.65,69.85 v143.38,68.58
!MD8  (via drill 0.81)
  Top 0.406: U$1.DK1 32.89,8.89 32.89,15.24 v34.16,21.59 v36.7,21.59 | v88.77,27.94 E35.7 91.31,35.56 v91.31,63.5
  Bottom 0.406: v91.31,63.5 96.39,63.5 98.93,66.04 101.47,66.04 104.01,63.5 120.52,63.5 126.87,69.85 126.87,73.66 E28.4 | v34.16,21.59 v36.7,21.59 43.05,27.94 v88.77,27.94
!MD9  (via drill 0.81)
  Top 0.406: U$1.DL1 29.08,8.89 29.08,21.59 37.97,26.67 39.24,27.94 39.24,40.64 40.51,41.91 v44.32,41.91 | E35.4 84.96,43.18 v84.96,53.34
  Bottom 0.406: v44.32,41.91 44.32,48.26 46.86,50.8 78.61,50.8 v84.96,53.34
!MD10  (via drill 0.81)
  Top 0.406: U$1.DM1 26.54,7.62 26.54,22.86 37.97,29.21 37.97,41.91 v41.78,44.45 | E35.12 101.47,46.99 v101.47,53.34
  Bottom 0.406: v41.78,44.45 41.78,48.26 45.59,52.07 74.8,52.07 82.42,55.88 86.23,55.88 88.77,53.34 v101.47,53.34
!MD11  (via drill 0.81)
  Top 0.406: U$1.DP1 20.19,8.89 20.19,15.24 18.92,16.51 18.92,21.59 31.62,31.75 v31.62,52.07 | E35.9 102.74,39.37 v102.74,57.15
  Bottom 0.406: v31.62,52.07 34.16,53.34 74.8,53.34 81.15,57.15 86.23,57.15 88.77,54.61 100.2,54.61 v102.74,57.15
!POWER_OK  (via drill 0.81)
  Top 0.406: v200.53,114.3 200.53,107.95 201.8,106.68 201.8,96.52 204.34,93.98 204.34,86.36 201.8,83.82 201.8,74.93 200.53,73.66 200.53,67.31 205.61,63.5 205.61,44.45 E10.3
  Bottom 0.406: E25.8 158.62,100.33 162.43,106.68 163.7,106.68 164.97,107.95 164.97,116.84 168.78,120.65 197.99,120.65 200.53,118.11 v200.53,114.3
!PRESET
  Top 0.406: E3.1 243.71,114.3 243.71,99.06 244.98,97.79 244.98,91.44 247.52,88.9 247.52,71.12 E2.6 | E6.1 222.12,85.09 222.12,106.68 223.39,107.95 223.39,115.57 E7.1
  Bottom 0.406: E7.1 E7.13 236.09,113.03 239.9,113.03 E3.1
!RX_ACTIVE  (via drill 0.81)
  Top 0.406: E1.6 244.98,36.83 244.98,49.53 246.25,50.8 246.25,58.42 244.98,59.69 244.98,71.12 E2.5 E2.4 243.71,77.47 243.71,85.09 241.17,87.63 v241.17,93.98
  Bottom 0.406: E17.13 201.8,107.95 201.8,97.79 205.61,95.25 238.63,95.25 v241.17,93.98
!RX_CLK  (via drill 0.81)
  Top 0.406: E6.9 236.09,69.85 | 236.09,69.85 236.09,83.82 237.36,85.09 237.36,95.25 239.9,99.06 v239.9,104.14 | v243.71,54.61 243.71,55.88 242.44,57.15 242.44,60.96 236.09,66.04 236.09,69.85
  Bottom 0.406: E1.11 256.41,41.91 256.41,49.53 250.06,54.61 v243.71,54.61 | v239.9,104.14 E3.6 250.06,106.68 250.06,109.22 E3.12
!RX_CLR  (via drill 0.81)
  Top 0.406: E40.10 78.61,73.66 78.61,82.55 77.34,83.82 77.34,95.25 74.8,97.79 74.8,104.14 E41.10 | v256.41,97.79 257.68,96.52 257.68,34.29 255.14,30.48 253.87,30.48 252.6,31.75 252.6,36.83 E1.10
  Bottom 0.406: E51.4 E51.10 24,74.93 24,81.28 25.27,82.55 57.02,82.55 58.29,81.28 58.29,78.74 63.37,73.66 E40.4 E40.10 78.61,71.12 87.5,85.09 90.04,85.09 92.58,87.63 98.93,87.63 100.2,88.9 143.38,88.9 144.65,87.63 158.62,87.63 161.16,90.17 164.97,90.17 168.78,93.98 197.99,93.98 199.26,92.71 199.26,88.9 200.53,87.63 204.34,87.63 205.61,86.36 209.42,86.36 | E41.10 E41.4 63.37,107.95 60.83,110.49 60.83,115.57 57.02,119.38 26.54,119.38 24,116.84 24,110.49 E52.10 E52.4 | E11.8 211.96,69.85 211.96,80.01 209.42,82.55 209.42,86.36 | 209.42,86.36 223.39,86.36 227.2,87.63 248.79,87.63 256.41,91.44 v256.41,97.79
!RX_FLAG  (via drill 0.81)
  Top 0.406: E42.8 81.15,138.43 81.15,161.29 v83.69,163.83 | E17.4 184.02,110.49 v184.02,128.27 | E26.5 147.19,142.24 147.19,161.29 v151,170.18
  Bottom 0.406: E26.5 153.54,135.89 153.54,133.35 154.81,132.08 158.62,132.08 159.89,133.35 159.89,137.16 162.43,139.7 164.97,139.7 166.24,138.43 166.24,133.35 167.51,132.08 171.32,132.08 177.67,127 v184.02,128.27 | v83.69,163.83 92.58,163.83 98.93,168.91 110.36,168.91 111.63,170.18 114.17,170.18 115.44,168.91 143.38,168.91 144.65,170.18 v151,170.18
!SET_RR
  Top 0.406: E30.11 E30.10
  Bottom 0.406: E46.10 64.64,139.7 65.91,138.43 65.91,133.35 70.99,128.27 81.15,128.27 90.04,119.38 121.79,119.38 124.33,121.92 131.95,121.92 134.49,127 138.3,127 143.38,123.19 145.92,123.19 147.19,124.46 147.19,127 134.49,133.35 134.49,137.16 E30.10
!SKIP
  Top 0.406: U$1.CS1 83.69,10.16 83.69,20.32 93.85,30.48 98.93,30.48 104.01,36.83 104.01,43.18 105.28,44.45 105.28,82.55 106.55,83.82 106.55,113.03 E33.1
  Bottom 0.406: E33.1 114.17,113.03 | 114.17,113.03 E33.13 | E33.10 115.44,105.41 114.17,106.68 114.17,113.03
!STOP1
  Top 0.406: STOP.3 182.75,76.2 182.75,39.37 E15.6
!STOP2  (via drill 0.81)
  Top 0.406: E19.6 164.97,38.1 v164.97,53.34
  Bottom 0.406: STOP.1 180.21,57.15 STOP2.2 v164.97,53.34
!TCF  (via drill 0.81)
  Top 0.406: E29.2 126.87,115.57 v126.87,134.62
  Bottom 0.406: E38.11 110.36,128.27 117.98,128.27 119.25,128.27 v126.87,134.62
!TFL  (via drill 0.81)
  Top 0.406: E38.13 98.93,144.78 98.93,162.56 v97.66,163.83 | E26.8 158.62,135.89 158.62,139.7 159.89,140.97 159.89,157.48 v162.43,163.83
  Bottom 0.406: v97.66,163.83 101.47,167.64 109.09,167.64 110.36,166.37 144.65,166.37 145.92,167.64 147.19,167.64 148.46,166.37 159.89,166.37 v162.43,163.83
!TFLNOW  (via drill 0.81)
  Top 0.406: E21.10 178.94,107.95 v178.94,134.62
  Bottom 0.406: E22.4 173.86,138.43 173.86,134.62 175.13,133.35 177.67,133.35 v178.94,134.62
!TLS  (via drill 0.81)
  Top 0.406: E29.5 124.33,110.49 v124.33,125.73
  Bottom 0.406: E38.4 93.85,138.43 93.85,132.08 96.39,129.54 101.47,129.54 107.82,123.19 121.79,123.19 v124.33,125.73 | E29.5 128.14,105.41 126.87,106.68 126.87,114.3 128.14,115.57 E29.1
!TP3
  Bottom 0.406: E22.2 E26.11 154.81,142.24 | E26.3 154.81,142.24 | 154.81,142.24 154.81,138.43 156.08,137.16 E26.9
!TPC  (via drill 0.81)
  Top 0.406: E29.4 125.6,111.76 v125.6,130.81
  Bottom 0.406: E38.9 101.47,132.08 110.36,127 120.52,127 v125.6,130.81
!TPCNOW  (via drill 0.81)
  Top 0.406: E43.11 E43.10 | E47.10 E47.11 | E42.4 65.91,139.7 v65.91,128.27 | v31.62,130.81 v31.62,87.63 31.62,54.61 30.35,52.07 30.35,39.37 E47.5 | v143.38,92.71 R20.1
  Bottom 0.406: E47.7 29.08,31.75 30.35,33.02 30.35,36.83 | 30.35,36.83 E47.5 | 30.35,36.83 E47.10 39.24,34.29 44.32,34.29 | 44.32,34.29 E43.5 E43.10 | E43.7 44.32,34.29 | E32.13 124.33,80.01 125.6,81.28 125.6,82.55 128.14,85.09 139.57,85.09 R20.1 | v31.62,130.81 35.43,129.54 55.75,129.54 v65.91,128.27 | v31.62,87.63 86.23,87.63 87.5,88.9 87.5,92.71 88.77,93.98 142.11,93.98 v143.38,92.71
!TSF  (via drill 0.81)
  Top 0.406: E38.12 100.2,143.51 100.2,162.56 v101.47,163.83 | E25.2 148.46,114.3 148.46,127 145.92,129.54 v145.92,165.1
  Bottom 0.406: v101.47,163.83 104.01,166.37 107.82,166.37 109.09,165.1 v145.92,165.1
!TSK  (via drill 0.81)
  Top 0.406: E25.6 145.92,105.41 145.92,124.46 v144.65,125.73
  Bottom 0.406: E38.3 86.23,142.24 86.23,132.08 90.04,128.27 101.47,128.27 107.82,121.92 123.06,121.92 128.14,127 131.95,127 133.22,128.27 139.57,128.27 v144.65,125.73
!TX_BUSY  (via drill 0.81)
  Top 0.406: E22.10 177.67,138.43 178.94,138.43 181.48,135.89 v181.48,109.22 181.48,104.14 180.21,102.87 180.21,97.79 181.48,96.52 181.48,85.09 v180.21,82.55
  Bottom 0.406: E21.12 v181.48,109.22 | E16.1 v180.21,82.55
!TX_FLAG  (via drill 0.81)
  Top 0.406: v145.92,100.33 v145.92,92.71
  Bottom 0.406: E25.3 145.92,107.95 v145.92,100.33 | E17.5 E21.8 172.59,96.52 166.24,96.52 163.7,93.98 147.19,93.98 v145.92,92.71
!XMIT_ACTIVE  (via drill 0.81)
  Top 0.406: E15.8 204.34,43.18 v204.34,62.23
  Bottom 0.406: E6.11 231.01,73.66 231.01,67.31 227.2,63.5 219.58,63.5 217.04,62.23 v204.34,62.23
+3V  (via drill 0.81)
  Top 0.813: E9.3 E9.4 223.39,176.53 223.39,167.64 227.2,163.83 227.2,162.56 223.39,158.75 223.39,154.94 | E9.10 E9.11 | v63.37,82.55 63.37,105.41 65.91,106.68 65.91,114.3 | 65.91,114.3 E41.1 | 65.91,114.3 62.1,118.11 62.1,161.29 | v60.83,161.29 62.1,161.29 | v63.37,161.29 62.1,161.29 | E4.3 242.44,147.32 v242.44,154.94 | E8.3 228.47,147.32 228.47,151.13 v224.66,154.94 223.39,154.94 | 223.39,154.94 v222.12,154.94 | v167.51,167.64 172.59,163.83 172.59,153.67 | 172.59,153.67 v173.86,153.67 | 172.59,153.67 v171.32,153.67 | 172.59,153.67 172.59,135.89 171.32,134.62 171.32,127 170.05,125.73 170.05,123.19 171.32,120.65 171.32,110.49 E21.4 166.24,105.41 166.24,102.87 162.43,100.33 162.43,88.9 E20.1 164.97,80.01 164.97,58.42 167.51,55.88 E19.1 | E42.10 73.53,137.16 73.53,133.35 78.61,127 78.61,115.57 E41.13 | E15.10 199.26,43.18 v199.26,52.07 | v129.41,171.45 R1.1
  Bottom 0.813: R1.1 R2.2 | E5.3 247.52,181.61 248.79,182.88 248.79,187.96 247.52,189.23 243.71,189.23 242.44,187.96 242.44,180.34 241.17,179.07 E9.11 E9.4 | E51.1 E51.13 22.73,85.09 60.83,85.09 v63.37,82.55 E40.1 E40.13 | E41.13 E41.1 65.91,115.57 59.56,121.92 22.73,121.92 18.92,118.11 18.92,115.57 E52.13 E52.1 | E19.1 E19.13 178.94,48.26 E15.1 190.37,52.07 v199.26,52.07 | E7.10 E7.4 E12.10 209.42,109.22 | E21.4 171.32,110.49 171.32,115.57 173.86,118.11 195.45,118.11 199.26,111.76 201.8,111.76 E12.1 209.42,114.3 209.42,109.22 | E12.4 209.42,109.22 | E13.3 201.8,147.32 201.8,154.94 | v171.32,153.67 v173.86,153.67 175.13,154.94 201.8,154.94 | 201.8,154.94 v222.12,154.94 v224.66,154.94 v242.44,154.94 | v60.83,161.29 v63.37,161.29 67.18,163.83 79.88,163.83 82.42,166.37 92.58,166.37 100.2,172.72 120.52,172.72 121.79,171.45 v129.41,171.45 140.84,171.45 142.11,172.72 161.16,172.72 v167.51,167.64
+15V
  Top 0.813: D8.C R24.2 R23.1 R25.1 62.1,180.34 68.45,171.45 92.58,171.45 93.85,172.72 101.47,172.72 102.74,171.45 102.74,168.91 101.47,167.64 95.12,167.64 82.42,157.48 82.42,34.29 C15.+
  Bottom 0.813: U$1.DA2 58.29,7.62 58.29,17.78 59.56,19.05 C15.+
-15V  (via drill 0.81)
  Top 0.813: 4.1 43.05,203.2 95.12,203.2 R10.1 | v54.48,19.05 49.4,24.13 | 49.4,24.13 v46.86,21.59 | 49.4,24.13 41.78,31.75 C16.-
  Bottom 0.813: U$1.DB2 54.48,8.89 v54.48,19.05 | v46.86,21.59 40.51,21.59 37.97,19.05 31.62,19.05 20.19,26.67 7.49,26.67 3.68,29.21 3.68,128.27 11.3,134.62 27.81,134.62 32.89,138.43 32.89,160.02 43.05,167.64 50.67,167.64 62.1,177.8 83.69,177.8 90.04,182.88 97.66,182.88 100.2,185.42 100.2,189.23 97.66,195.58 R10.1
BTP3  (via drill 0.81)
  Top 0.406: E27.3 125.6,46.99 125.6,52.07 v124.33,53.34 | v143.38,153.67 139.57,151.13 139.57,144.78 | 139.57,144.78 E30.12 | 139.57,144.78 139.57,113.03 v140.84,110.49 140.84,102.87 139.57,101.6 139.57,88.9 142.11,86.36 v142.11,85.09 138.3,81.28 138.3,53.34 v139.57,52.07
  Bottom 0.406: E29.12 v140.84,110.49 | E32.11 112.9,77.47 112.9,82.55 115.44,85.09 126.87,85.09 128.14,86.36 140.84,86.36 v142.11,85.09 | E22.1 164.97,153.67 v143.38,153.67 | v124.33,53.34 137.03,53.34 v139.57,52.07
CLEAR_RX_FLAG  (via drill 0.81)
  Top 0.406: E42.13 78.61,149.86 78.61,160.02 v74.8,166.37 | v147.19,176.53 153.54,171.45 v153.54,116.84
  Bottom 0.406: v74.8,166.37 77.34,168.91 91.31,168.91 98.93,175.26 145.92,175.26 v147.19,176.53 | E25.13 v153.54,116.84
DOKCC  (via drill 0.81)
  Top 0.406: E31.2 E31.3 | E31.8 E31.9 | v120.52,44.45 120.52,73.66 124.33,77.47 124.33,102.87 119.25,107.95 119.25,138.43 v123.06,148.59
  Bottom 0.406: E31.9 112.9,38.1 112.9,41.91 111.63,43.18 E31.3 | E31.2 114.17,50.8 117.98,50.8 120.52,46.99 v120.52,44.45 | E30.13 133.22,146.05 | 133.22,146.05 E30.3 | 133.22,146.05 130.68,151.13 125.6,151.13 v123.06,148.59
DOTCF
  Bottom 0.406: E29.13 E29.3
DOTPC  (via drill 0.81)
  Top 0.406: E32.12 119.25,80.01 119.25,100.33 v121.79,102.87
  Bottom 0.406: E29.6 v121.79,102.87
ENABLE  (via drill 0.81)
  Top 0.406: v41.78,111.76 35.43,137.16 35.43,140.97 44.32,147.32 v44.32,158.75 | v65.91,144.78 65.91,160.02 v69.72,166.37 | v192.91,160.02 v195.45,160.02 195.45,156.21 203.07,148.59 203.07,110.49 204.34,109.22 204.34,99.06 205.61,97.79 205.61,85.09 203.07,82.55 203.07,73.66 v201.8,72.39 v201.8,69.85
  Bottom 0.406: E45.2 v41.78,111.76 | E42.5 67.18,140.97 67.18,143.51 v65.91,144.78 | E16.4 177.67,69.85 177.67,67.31 180.21,64.77 194.18,64.77 196.72,67.31 196.72,78.74 197.99,80.01 201.8,80.01 203.07,78.74 203.07,76.2 v201.8,72.39 v201.8,69.85 | v44.32,158.75 46.86,161.29 55.75,161.29 58.29,163.83 64.64,163.83 68.45,166.37 v69.72,166.37 73.53,170.18 90.04,170.18 97.66,176.53 144.65,176.53 147.19,179.07 151,175.26 164.97,175.26 170.05,171.45 187.83,160.02 v192.91,160.02 v195.45,160.02
FREQ_DIV  (via drill 0.81)
  Top 0.406: E37.13 E37.12 | E37.10 E37.9 | v164.97,99.06 164.97,90.17 168.78,85.09 168.78,71.12 E20.6
  Bottom 0.406: E20.6 172.59,73.66 172.59,82.55 173.86,83.82 187.83,83.82 187.83,81.28 E16.2 | E37.10 97.66,105.41 98.93,106.68 98.93,109.22 97.66,110.49 E37.12 | E37.9 97.66,102.87 107.82,96.52 162.43,96.52 v164.97,99.06
GND  (via drill 0.81)
  Top 0.813: C5.2 V5.2 | V5.2 V5.1 | V5.2 160.53,189.23 149.1,189.23 148.46,187.96 | D7.A D6.A C9.2 | U$1.DT1 10.03,8.89 v10.03,17.78 v10.03,20.32 10.03,29.21 E50.7 11.3,34.29 11.3,57.15 | E47.1 27.81,57.15 | 27.81,57.15 C65.2 | 27.81,57.15 E48.7 30.35,68.58 30.35,90.17 C66.2 29.08,99.06 E49.7 30.35,102.87 30.35,124.46 C67.2 | U$1.DN1 22.73,8.89 v22.73,17.78 v20.19,17.78 | v49.4,19.05 v51.94,19.05 51.94,8.89 U$1.DC1 | U$1.DF1 41.78,8.89 C16.+ | U$1.CT1 79.88,8.89 v79.88,19.05 v77.34,19.05 | U$1.CN1 92.58,8.89 v92.58,19.05 v95.12,19.05 | U$1.CF1 111.63,8.89 v111.63,19.05 111.63,20.32 109.09,24.13 E31.7 111.63,34.29 111.63,55.88 C49.2 109.09,58.42 E32.7 111.63,69.85 111.63,85.09 110.36,86.36 C50.2 109.09,93.98 E33.7 | U$1.CC1 121.79,8.89 121.79,13.97 v117.98,19.05 v117.98,25.4 | U$1.BT1 143.38,8.89 143.38,16.51 v145.92,19.05 v145.92,21.59 | U$1.BN1 156.08,8.89 v156.08,19.05 v156.08,21.59 | U$1.BF1 175.13,8.89 v175.13,19.05 v172.59,19.05 E19.7 170.05,35.56 170.05,55.88 C37.2 168.78,66.04 E20.7 170.05,69.85 170.05,90.17 C38.2 E21.7 | U$1.BC1 185.29,8.89 v185.29,19.05 | v185.29,19.05 v182.75,19.05 | U$1.AT1 213.23,8.89 v213.23,19.05 v210.69,19.05 | U$1.AN1 225.93,8.89 v225.93,19.05 | v225.93,19.05 v228.47,19.05 | U$1.AF2 244.98,8.89 v244.98,19.05 v247.52,19.05 | E9.7 228.47,173.99 228.47,194.31 C28.2 | C33.2 209.42,171.45 E14.7 205.15,163.65 | E43.1 49.4,48.26 C61.2 49.4,64.77 E44.7 50.67,68.58 50.67,90.17 C62.2 49.4,99.06 E45.7 50.67,102.87 50.67,124.46 C63.2 48.13,127 E46.7 50.67,137.16 50.67,158.75 C64.2 | E51.7 11.3,66.04 | 11.3,66.04 11.3,57.15 | C68.2 11.3,57.15 | 11.3,66.04 11.3,90.17 C69.2 10.03,99.06 E52.7 11.3,102.87 C70.2
  Top 0.813: E35.1 90.04,49.53 C53.2 90.04,66.04 E36.7 91.31,69.85 91.31,90.17 C54.2 90.04,99.06 E37.7 86.23,102.87 86.23,120.65 C55.2 90.04,130.81 E38.8 91.31,134.62 91.31,158.75 C56.2 | E39.7 70.99,35.56 70.99,54.61 C57.2 69.72,64.77 E40.7 70.99,68.58 70.99,88.9 C58.2 68.45,91.44 E41.7 | C51.2 110.36,129.54 E34.8 111.63,134.62 111.63,153.67 C52.2 | C39.2 170.05,128.27 170.05,133.35 E22.7 171.32,137.16 171.32,149.86 168.78,152.4 168.78,158.75 C40.2 | C59.2 70.99,127 70.99,134.62 | 70.99,134.62 E42.7 | E42.2 70.99,147.32 | 70.99,147.32 70.99,134.62 | C60.2 70.99,158.75 70.99,147.32 | E23.1 149.73,49.53 C41.2 151,58.42 151,82.55 | E10.1 208.15,49.53 C29.2 208.15,66.04 E11.7 209.42,69.85 209.42,90.17 C30.2 208.15,100.33 E12.7 209.42,104.14 C31.2 | v185.29,19.05 190.37,27.94 C71.2 E15.7 189.1,35.56 189.1,55.88 C34.2 187.83,66.04 E16.7 189.1,69.85 189.1,90.17 C35.2 187.83,99.06 E17.7 189.1,102.87 C36.2 189.1,132.08 E18.7 | v225.93,19.05 222.12,25.4 213.23,25.4 209.42,27.94 209.42,38.1 E10.4 | C20.2 248.79,30.48 E1.7 248.79,35.56 248.79,43.18 E1.2 248.79,48.26 248.79,58.42 C21.2 247.52,66.04 E2.7 248.79,69.85 248.79,91.44 C22.2 247.52,100.33 E3.7 250.06,105.41 250.06,123.19 C23.2 | R27.1 D10.A E6.7 227.2,69.85 227.2,90.17 C25.2 225.93,100.33 E7.7 227.2,104.14 C26.2 | R16.1 R19.1 | E4.10 251.33,142.24 251.33,158.75 C24.2 251.33,161.29 251.33,173.99 E5.10 | 205.15,163.65 v204.34,160.02 | D1.C 199.26,165.1 205.15,163.65 | E8.10 236.09,142.24 236.09,152.4 C27.2 | E24.1 151,82.55 | 151,82.55 C42.2 151,99.06 E25.7 152.27,101.6 152.27,121.92 C43.2 E26.7 152.27,137.16 152.27,158.75 C44.2
  Top 0.813: C48.2 131.95,158.75 131.95,137.16 E30.7 129.41,125.73 C47.2 131.95,123.19 131.95,102.87 E29.7 130.68,99.06 C46.2 130.68,83.82 E28.1 131.95,80.01 131.95,58.42 C45.2 130.68,49.53 E27.1 131.95,45.72 131.95,40.64 E27.5 E27.6 | T1.4 181.48,179.07 178.94,181.61 | 178.94,181.61 177.67,181.61 175.13,179.07 167.51,179.07 V5.1 | V5.1 156.08,182.88 v154.81,181.61 148.46,187.96 | 148.46,187.96 C2.2 | C2.2 Y1.2 | C1.- 178.94,181.61 | E13.10 211.96,142.24 211.96,149.86 214.5,152.4 C32.2 | C8.- D3.A 107.82,201.93 124.33,201.93 129.41,195.58 130.68,194.31 142.11,194.31 C2.2
  Bottom 0.813: 22.73,157.48 0.1 27.81,157.48 30.35,160.02 34.16,167.64 39.24,171.45 Q3.1 50.67,175.26 53.21,177.8 C9.2 | 22.73,157.48 22.73,186.69 24,187.96 GND.1 | U$1.DT1 10.03,8.89 v10.03,17.78 | v10.03,17.78 v10.03,20.32 2.41,25.4 2.41,130.81 17.65,143.51 22.73,149.86 22.73,157.48 | U$1.DN1 22.73,8.89 v22.73,17.78 | v22.73,17.78 v20.19,17.78 v10.03,17.78 | U$1.DF1 41.78,8.89 41.78,17.78 | 41.78,17.78 C16.+ v49.4,19.05 v51.94,19.05 | 41.78,17.78 v22.73,17.78 | U$1.DC1 51.94,8.89 v51.94,19.05 | U$1.CT1 79.88,8.89 v79.88,19.05 | v79.88,19.05 v77.34,19.05 69.72,22.86 60.83,22.86 58.29,21.59 54.48,21.59 v51.94,19.05 | U$1.CN1 92.58,8.89 v92.58,19.05 | v92.58,19.05 v79.88,19.05 | U$1.CF1 111.63,8.89 v111.63,19.05 | v111.63,19.05 106.55,22.86 101.47,22.86 v95.12,19.05 v92.58,19.05 | U$1.CC1 121.79,8.89 121.79,13.97 v117.98,19.05 v111.63,19.05 | U$1.BT1 143.38,8.89 143.38,16.51 v145.92,19.05 | v145.92,19.05 v145.92,21.59 139.57,25.4 v117.98,25.4 | U$1.BN1 156.08,8.89 v156.08,19.05 | v156.08,19.05 v156.08,21.59 | v145.92,19.05 v156.08,19.05 | U$1.BC1 185.29,8.89 v185.29,19.05 | v185.29,19.05 v182.75,19.05 v175.13,19.05 | v175.13,19.05 v172.59,19.05 v156.08,19.05 | U$1.BF1 175.13,8.89 v175.13,19.05 | U$1.AT1 213.23,8.89 v213.23,19.05 | v213.23,19.05 v210.69,19.05 205.61,22.86 190.37,22.86 v185.29,19.05 | U$1.AN1 225.93,8.89 v225.93,19.05 | v225.93,19.05 v213.23,19.05 | U$1.AF2 244.98,8.89 v244.98,19.05 | v244.98,19.05 243.71,19.05 241.17,16.51 237.36,16.51 234.82,19.05 | 234.82,19.05 v228.47,19.05 v225.93,19.05 | U$1.AC2 255.14,8.89 255.14,13.97 250.06,19.05 v247.52,19.05 v244.98,19.05 | R2.1 111.63,193.04 109.09,193.04 105.28,196.85 D3.A
  Bottom 0.813: C33.2 211.96,198.12 224.66,198.12 C28.2 | D1.C 197.99,168.91 194.18,166.37 190.37,166.37 187.83,168.91 | T1.8 187.83,168.91 | 187.83,168.91 187.83,177.8 186.56,179.07 T1.4 | E39.7 64.64,34.29 C15.- | C69.2 12.57,93.98 26.54,93.98 C66.2 31.62,93.98 36.7,93.98 C62.2 51.94,93.98 65.91,93.98 C58.2 | E42.2 63.37,147.32 E46.12 | R12.1 191.64,132.08 E18.7 | C19.- E27.5 E27.10 | C64.2 51.94,157.48 69.72,157.48 | 69.72,157.48 C60.2 | C40.2 170.05,157.48 | 170.05,157.48 151,157.48 | 151,157.48 130.68,157.48 | 130.68,157.48 110.36,157.48 | 110.36,157.48 90.04,157.48 | 90.04,157.48 69.72,157.48 | C56.2 90.04,157.48 | C52.2 110.36,157.48 | C48.2 130.68,157.48 | C44.2 151,157.48 | C24.2 250.06,157.48 232.28,157.48 | 232.28,157.48 214.5,157.48 | 214.5,157.48 204.34,157.48 | 204.34,157.48 170.05,157.48 | C32.2 214.5,157.48 | C27.2 232.28,157.48 | E10.10 213.23,38.1 210.69,40.64 | 210.69,40.64 210.69,45.72 E10.1 | E10.4 210.69,40.64 | E1.7 250.06,35.56 250.06,40.64 E1.12 | C20.2 244.98,25.4 237.36,21.59 234.82,19.05 | C17.- E1.2 | R19.1 227.2,49.53 228.47,48.26 231.01,48.26 232.28,49.53 R27.1 | C29.2 210.69,54.61 213.23,54.61 217.04,57.15 227.2,57.15 229.74,59.69 D10.A | E11.7 201.8,67.31 199.26,69.85 199.26,74.93 C18.- | v204.34,160.02 204.34,157.48
INIT  (via drill 0.81)
  Top 0.406: U$1.CR1 86.23,10.16 86.23,20.32 v93.85,27.94
  Bottom 0.406: E27.9 130.68,31.75 119.25,31.75 116.71,29.21 107.82,29.21 105.28,27.94 v93.85,27.94
INITIALIZE  (via drill 0.81)
  Top 0.406: E5.2 243.71,181.61 243.71,157.48 244.98,154.94 244.98,152.4 243.71,149.86 243.71,148.59 244.98,147.32 E4.2 | v219.58,73.66 v219.58,76.2 220.85,77.47 220.85,82.55 219.58,85.09 219.58,109.22 220.85,110.49 v220.85,120.65 223.39,124.46 223.39,146.05 E8.2 | v159.89,52.07 159.89,74.93 158.62,76.2 158.62,102.87 v163.7,109.22 | E11.4 E11.5 | E11.1 E11.2
  Bottom 0.406: E13.2 205.61,148.59 205.61,151.13 206.88,152.4 223.39,152.4 | 223.39,152.4 223.39,148.59 224.66,147.32 E8.2 | E4.2 237.36,152.4 223.39,152.4 | E27.14 142.11,48.26 145.92,52.07 v159.89,52.07 | E11.4 208.15,74.93 209.42,76.2 209.42,78.74 208.15,80.01 E11.2 | E11.5 213.23,66.04 215.77,66.04 219.58,68.58 v219.58,73.66 v219.58,76.2 | v163.7,109.22 163.7,118.11 167.51,121.92 195.45,121.92 197.99,124.46 201.8,124.46 204.34,121.92 217.04,121.92 218.31,120.65 v220.85,120.65
INT_ENA  (via drill 0.81)
  Top 0.406: U$1.CB1 124.33,8.89 124.33,15.24 121.79,17.78 121.79,20.32 123.06,21.59 123.06,35.56 119.25,40.64 119.25,74.93 120.52,76.2 120.52,97.79 v121.79,99.06
  Bottom 0.406: E33.6 111.63,102.87 116.71,97.79 120.52,97.79 v121.79,99.06 123.06,97.79 161.16,97.79 164.97,101.6 167.51,101.6 E21.6
IO_PAUSE  (via drill 0.81)
  Top 0.406: E10.6 v201.8,34.29 v201.8,31.75 | E35.6 E35.5 | E35.10 E35.11 | E28.5 126.87,69.85 126.87,52.07 127.08,48.41 E27.2 | E23.5 E23.6 | E23.11 E23.10 | v159.89,40.64 162.43,43.18 v162.43,86.36
  Bottom 0.406: E35.5 E35.10 | E35.11 101.47,44.45 101.47,46.99 107.82,53.34 120.52,53.34 123.06,50.8 124.33,50.8 128.14,45.72 E27.2 131.95,45.72 134.49,40.64 E27.11 143.38,39.37 E23.5 E23.10 162.43,35.56 162.43,31.75 168.78,26.67 197.99,26.67 v201.8,31.75 v201.8,34.29 | E23.11 v159.89,40.64 | E24.12 158.62,80.01 158.62,82.55 v162.43,86.36
LAST_UNIT  (via drill 0.81)
  Top 0.406: E12.9 217.04,106.68 217.04,120.65 219.58,123.19 v219.58,125.73
  Bottom 0.406: E3.13 252.6,114.3 247.52,119.38 242.44,119.38 238.63,123.19 231.01,123.19 228.47,128.27 222.12,128.27 v219.58,125.73
N$1  (via drill 0.81)
  Top 0.406: E25.11 161.16,111.76 v161.16,129.54
  Bottom 0.406: E30.8 149.73,129.54 v161.16,129.54
N$2
  Top 0.406: E47.13 43.05,49.53 43.05,64.77 40.51,67.31 40.51,72.39 39.24,73.66 39.24,76.2 37.97,77.47 37.97,104.14 E49.10
N$3
  Top 0.406: E47.14 37.97,49.53 37.97,69.85 E48.10
N$4
  Top 0.406: E47.2 25.27,46.99 25.27,71.12 E48.4
N$5
  Top 0.406: E47.3 24,45.72 24,105.41 E49.4
N$6  (via drill 0.81)
  Top 0.406: v41.78,68.58 43.05,71.12 43.05,73.66 44.32,74.93 44.32,77.47 40.51,81.28 40.51,106.68 E49.12
  Bottom 0.406: E48.9 v41.78,68.58
N$7  (via drill 0.81)
  Top 0.406: v142.11,100.33 142.11,107.95 143.38,109.22 143.38,111.76 140.84,114.3 140.84,118.11 v142.11,120.65 | E22.5 166.24,137.16 166.24,130.81 v167.51,129.54
  Bottom 0.406: E29.8 v142.11,100.33 | v142.11,120.65 154.81,120.65 v167.51,129.54
N$8
  Top 0.406: V4.1 V4.2 C4.2 | R4.2 C6.1
  Bottom 0.406: C6.1 143.38,187.96 168.78,187.96 V4.2 | Q1.1 130.68,186.69 134.49,186.69 R4.2 | C5.1 164.97,200.66 175.13,200.66 176.4,199.39 176.4,195.58 V4.2 | V4.2 C4.2
N$9
  Top 0.406: E43.13 60.83,46.99 60.83,72.39 58.29,73.66 58.29,104.14 E45.10
N$10
  Top 0.406: E43.14 58.29,49.53 58.29,69.85 E44.10
N$11
  Top 0.406: E43.3 45.59,44.45 45.59,105.41 E45.4
N$12
  Top 0.406: E43.2 46.86,45.72 46.86,72.39 E44.4
N$13
  Top 0.406: E45.5 46.86,104.14 46.86,80.01 E44.2
N$14  (via drill 0.81)
  Top 0.406: E44.12 57.02,74.93 57.02,72.39 59.56,71.12 v59.56,64.77
  Bottom 0.406: E44.5 50.67,71.12 53.21,68.58 53.21,64.77 54.48,63.5 58.29,63.5 v59.56,64.77
N$15  (via drill 0.81)
  Top 0.406: v62.1,71.12 62.1,76.2 59.56,78.74 59.56,107.95 E45.12
  Bottom 0.406: E44.9 v62.1,71.12
N$16
  Bottom 0.406: E49.2 26.54,114.3 26.54,116.84 27.81,118.11 55.75,118.11 58.29,115.57 58.29,104.14 57.02,102.87 E45.9
N$17
  Top 0.406: E49.5 25.27,104.14 25.27,81.28 E48.2
N$18  (via drill 0.81)
  Top 0.406: E48.12 37.97,74.93 37.97,72.39 39.24,71.12 v39.24,63.5
  Bottom 0.406: E48.5 30.35,71.12 34.16,63.5 v39.24,63.5
N$19
  Top 0.406: 7.1 45.59,200.66 83.69,200.66 C7.1 93.85,189.23
  ECO 0.406: R30.1 C7.1
N$20
  Bottom 0.406: E48.8 41.78,66.04 48.13,60.96 78.61,60.96 86.23,68.58 86.23,69.85 E36.5
N$21
  Bottom 0.406: E48.6 30.35,68.58 34.16,59.69 78.61,59.69 E36.6
N$22  (via drill 0.81)
  Top 0.406: E36.2 86.23,82.55 v86.23,91.44
  Bottom 0.406: E49.6 31.62,101.6 34.16,97.79 40.51,95.25 79.88,95.25 v86.23,91.44
N$23  (via drill 0.81)
  Top 0.406: v97.66,97.79 98.93,96.52 98.93,80.01 E36.12
  Bottom 0.406: E45.8 57.02,99.06 86.23,99.06 88.77,97.79 v97.66,97.79
N$24
  Bottom 0.406: E44.8 57.02,66.04 58.29,67.31 63.37,67.31 68.45,63.5 78.61,63.5 83.69,68.58 83.69,73.66 E36.3
N$25
  Bottom 0.406: E44.6 50.67,68.58 51.94,67.31 51.94,64.77 54.48,62.23 78.61,62.23 84.96,68.58 84.96,71.12 E36.4
N$26  (via drill 0.81)
  Top 0.406: E36.1 87.5,83.82 v87.5,96.52
  Bottom 0.406: E45.6 50.67,102.87 55.75,97.79 82.42,97.79 v87.5,96.52
N$28  (via drill 0.81)
  Top 0.406: v44.32,96.52 44.32,144.78 E46.2
  Bottom 0.406: E49.9 40.51,101.6 v44.32,96.52
N$31  (via drill 0.81)
  Top 0.406: U$1.DB1 54.48,8.89 54.48,15.24 55.75,16.51 55.75,20.32 51.94,24.13 v51.94,132.08
  Bottom 0.406: R22.1 R21.1 E46.5 51.94,137.16 v51.94,132.08
N$32  (via drill 0.81)
  Top 0.406: E22.11 177.67,143.51 177.67,160.02 178.94,161.29 181.48,161.29 v182.75,160.02 | v114.17,87.63 112.9,88.9 112.9,165.1 v117.98,170.18
  Bottom 0.406: E36.8 91.31,69.85 91.31,85.09 92.58,86.36 98.93,86.36 100.2,87.63 v114.17,87.63 | v117.98,170.18 142.11,170.18 143.38,171.45 159.89,171.45 167.51,165.1 175.13,165.1 v182.75,160.02
N$33  (via drill 0.81)
  Top 0.406: E35.2 87.5,46.99 v87.5,62.23
  Bottom 0.406: E24.11 162.43,71.12 162.43,59.69 158.62,55.88 153.54,55.88 148.46,60.96 145.92,60.96 144.65,62.23 104.01,62.23 101.47,64.77 98.93,64.77 96.39,62.23 v87.5,62.23
N$34
  Top 0.406: E24.6 147.19,68.58 147.19,46.99 E23.2
N$35  (via drill 0.81)
  Top 0.406: E23.3 152.27,46.99 152.27,63.5 v153.54,64.77
  Bottom 0.406: E28.10 140.84,74.93 144.65,74.93 145.92,73.66 145.92,66.04 148.46,64.77 v153.54,64.77
N$36
  Top 0.406: E23.14 157.35,49.53 157.35,68.58 E24.9
  Bottom 0.406: E28.11 134.49,72.39 134.49,67.31 137.03,64.77 144.65,64.77 145.92,63.5 151,63.5 152.27,62.23 156.08,62.23 158.62,64.77 158.62,68.58 E24.9
N$37
  Top 0.406: E23.13 158.62,48.26 158.43,70.83 E24.10
  Bottom 0.406: E28.6 135.76,63.5 144.65,63.5 145.92,62.23 151,62.23 152.27,60.96 157.35,60.96 159.89,63.5 159.89,69.85 E24.10
N$38  (via drill 0.81)
  Top 0.406: v171.32,64.77 v171.32,60.96
  Bottom 0.406: E10.2 204.34,48.26 204.34,52.07 201.8,54.61 190.37,54.61 186.56,50.8 164.97,50.8 163.7,52.07 163.7,54.61 164.97,55.88 170.05,55.88 171.32,57.15 v171.32,60.96 | E28.12 144.65,77.47 147.19,74.93 E24.4 152.27,77.47 152.27,82.55 154.81,85.09 158.62,85.09 161.16,87.63 163.7,87.63 163.7,85.09 159.89,81.28 159.89,74.93 163.7,72.39 163.7,67.31 167.51,64.77 v171.32,64.77
N$39  (via drill 0.81)
  Top 0.406: v143.38,144.78 v143.38,142.24 142.11,139.7 142.11,124.46 143.38,121.92 v143.38,115.57 | E33.9 E33.8
  Bottom 0.406: E33.9 124.33,109.22 124.33,114.3 126.87,116.84 138.3,116.84 139.57,115.57 v143.38,115.57 | E26.4 v143.38,142.24 v143.38,144.78
N$40  (via drill 0.81)
  Top 0.406: E35.14 101.47,58.42 104.01,60.96 104.01,82.55 105.28,83.82 105.28,114.3 106.55,115.57 106.55,146.05 v104.01,147.32
  Bottom 0.406: E38.15 v104.01,147.32 106.55,151.13 106.55,152.4 107.82,153.67 111.63,153.67 114.17,151.13 114.17,148.59 E34.15
N$41  (via drill 0.81)
  Top 0.406: E35.13 95.12,46.99 95.12,49.53 100.2,59.69 102.74,62.23 102.74,82.55 104.01,83.82 104.01,115.57 105.28,116.84 v105.28,144.78
  Bottom 0.406: E38.14 v105.28,144.78 107.82,148.59 107.82,151.13 109.09,152.4 110.36,152.4 111.63,151.13 111.63,147.32 E34.14
N$42  (via drill 0.81)
  Top 0.406: E35.3 86.23,45.72 86.23,78.74 84.96,80.01 84.96,147.32 E38.1 | E34.1 105.28,149.86 v104.01,151.13
  Bottom 0.406: E38.1 90.04,151.13 v104.01,151.13
N$43
  Top 0.406: E33.12 E33.11
  Bottom 0.406: E33.12 117.98,110.49 125.6,118.11 139.57,118.11 140.84,116.84 145.92,116.84 E25.1
N$44  (via drill 0.81)
  Top 0.406: E17.6 182.75,102.87 181.48,101.6 181.48,99.06 182.75,97.79 182.75,86.36 185.29,83.82 v185.29,53.34 | v181.48,53.34 180.21,52.07 180.21,22.86 v178.94,21.59 | v112.9,26.67 112.9,86.36 111.63,87.63 111.63,102.87 E33.5
  Bottom 0.406: E33.5 110.36,105.41 111.63,106.68 111.63,109.22 110.36,110.49 E33.3 | v181.48,53.34 v185.29,53.34 | v112.9,26.67 114.17,27.94 116.71,27.94 119.25,30.48 130.68,30.48 135.76,26.67 158.62,26.67 164.97,21.59 v178.94,21.59
N$45  (via drill 0.81)
  Top 0.406: v159.89,45.72 161.16,46.99 161.16,76.2 159.89,77.47 159.89,100.33 v163.7,105.41
  Bottom 0.406: E27.13 142.11,45.72 147.19,50.8 157.35,50.8 159.89,46.99 v159.89,45.72 | E21.2 166.24,111.76 166.24,106.68 164.97,105.41 v163.7,105.41
N$46
  Bottom 0.406: E33.2 106.55,115.57 107.82,116.84 121.79,116.84 124.33,119.38 140.84,119.38 142.11,118.11 149.73,118.11 152.27,115.57 152.27,110.49 E25.4
N$47  (via drill 0.81)
  Top 0.406: v163.7,147.32 162.43,146.05 162.43,139.7 161.16,138.43 161.16,134.62 163.7,132.08 163.7,113.03 E21.3
  Bottom 0.406: E26.13 v163.7,147.32
N$50